# Altium project GatewayRPICM5.PrjPcb (part 1 of 2)
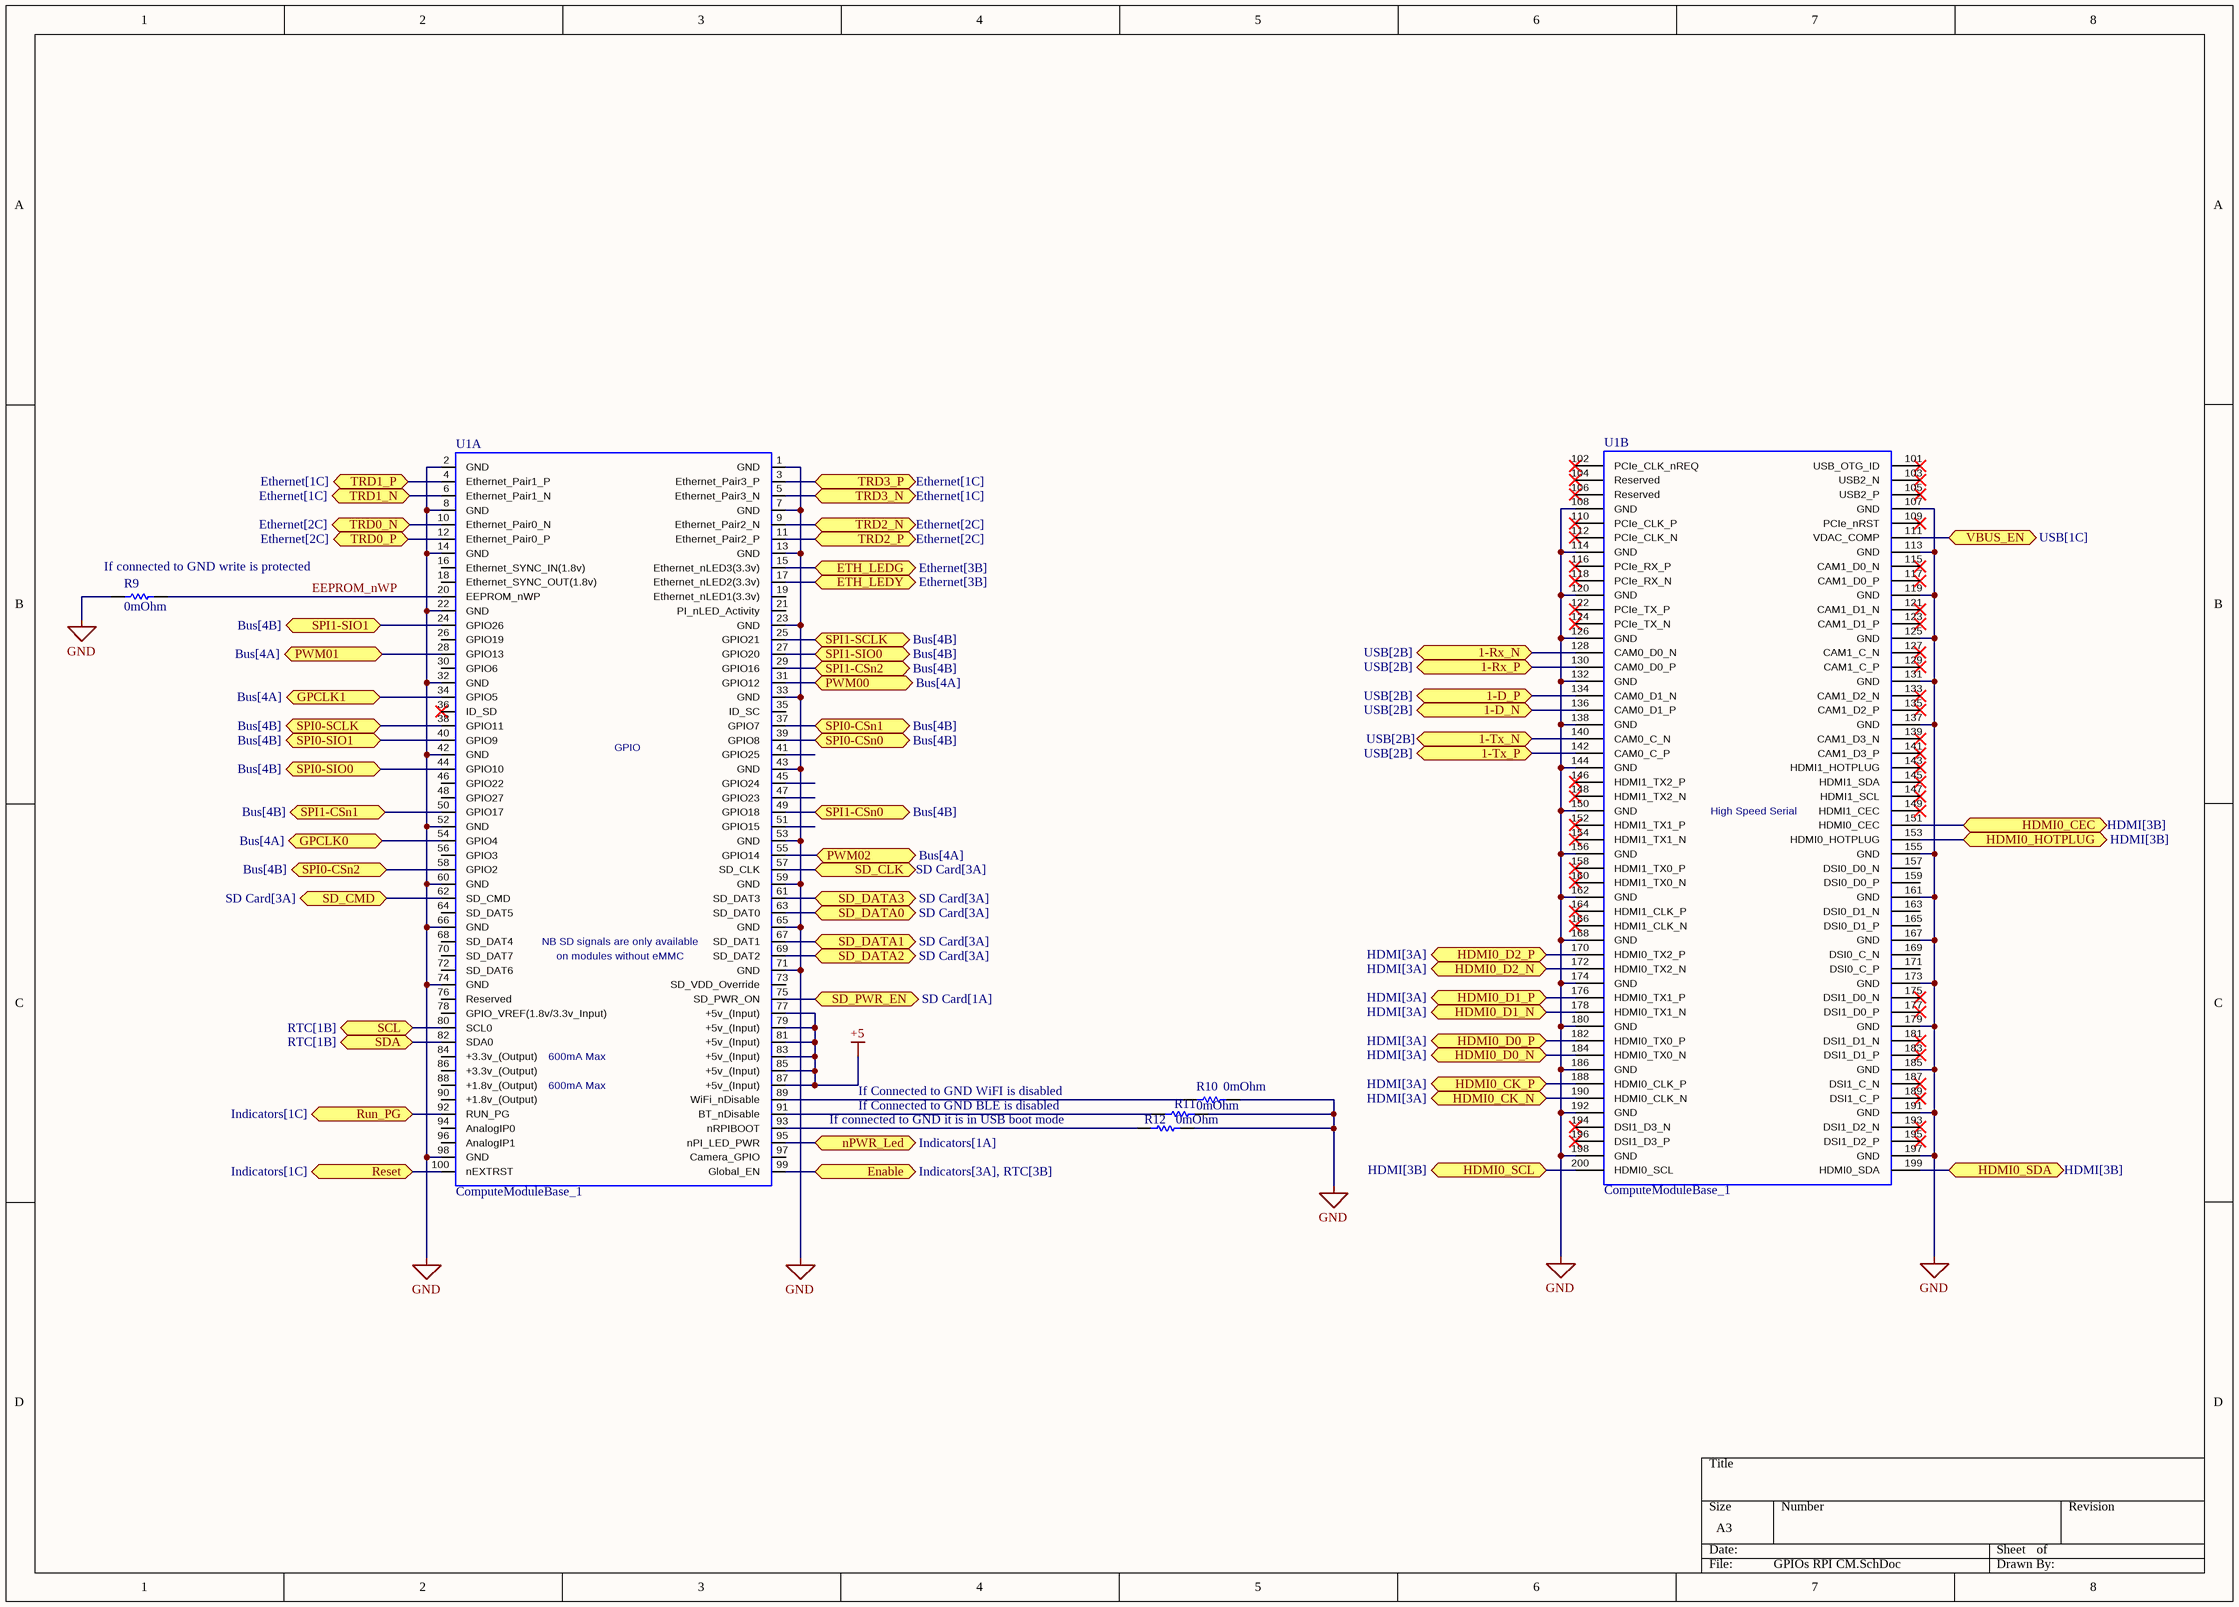
[diagram p0: GPIOs RPI CM.SchDoc]
11 sheets, 79 parts. Net scope: flat (ports and power ports of the same name join across sheets).
Board files: RPI_Gateway 1.0.0.PcbDoc, RPI_Gateway 1.0.1.PcbDoc, RPI_Gateway 1.0.2.PcbDoc
Sheets:
  GPIOs RPI CM.SchDoc
  SD Card.SchDoc
  Ethernet.SchDoc
  HDMI.SchDoc
  Indicators.SchDoc
  USB.SchDoc
  RTC.SchDoc
  Bus.SchDoc
  Security ATECC608.SchDoc
  Power.SchDoc
  High Speed RPI CM.SchDoc

## Sheet GPIOs RPI CM.SchDoc
size A3; SheetNumber: 1; SheetTotal: 11

### Parts
R9  Resistance: 0mOhm  [RESC1005X40X25LL05T05]  (hidden comment: ERJ2GE0R00X)
R10  Resistance: 0mOhm  [RESC1005X40X25LL05T05]  (hidden comment: ERJ2GE0R00X)
R11  Resistance: 0mOhm  [RESC1005X40X25LL05T05]  (hidden comment: ERJ2GE0R00X)
R12  Resistance: 0mOhm  [RESC1005X40X25LL05T05]  (hidden comment: ERJ2GE0R00X)
U1  ComputeModuleBase_1  [Raspberry-Pi-Compute-Module]  (parts A,B of 2)

### Ports
1-D_N (bidir, see USB[2B]), 1-D_P (bidir, see USB[2B]), 1-Rx_N (bidir, see USB[2B]), 1-Rx_P (bidir, see USB[2B]), 1-Tx_N (bidir, see USB[2B]), 1-Tx_P (bidir, see USB[2B]), Enable (bidir, see Indicators[3A], RTC[3B]), ETH_LEDG (bidir, see Ethernet[3B]), ETH_LEDY (bidir, see Ethernet[3B]), GPCLK0 (bidir, see Bus[4A]), GPCLK1 (bidir, see Bus[4A]), HDMI0_CEC (bidir, see HDMI[3B]), HDMI0_CK_N (bidir, see HDMI[3A]), HDMI0_CK_P (bidir, see HDMI[3A]), HDMI0_D0_N (bidir, see HDMI[3A]), HDMI0_D0_P (bidir, see HDMI[3A]), HDMI0_D1_N (bidir, see HDMI[3A]), HDMI0_D1_P (bidir, see HDMI[3A]), HDMI0_D2_N (bidir, see HDMI[3A]), HDMI0_D2_P (bidir, see HDMI[3A]), HDMI0_HOTPLUG (bidir, see HDMI[3B]), HDMI0_SCL (bidir, see HDMI[3B]), HDMI0_SDA (bidir, see HDMI[3B]), nPWR_Led (bidir, see Indicators[1A]), PWM00 (bidir, see Bus[4A]), PWM01 (bidir, see Bus[4A]), PWM02 (bidir, see Bus[4A]), Reset (bidir, see Indicators[1C]), Run_PG (bidir, see Indicators[1C]), SCL (bidir, see RTC[1B]), SD_CLK (bidir, see SD Card[3A]), SD_CMD (bidir, see SD Card[3A]), SD_DATA0 (bidir, see SD Card[3A]), SD_DATA1 (bidir, see SD Card[3A]), SD_DATA2 (bidir, see SD Card[3A]), SD_DATA3 (bidir, see SD Card[3A]), SD_PWR_EN (bidir, see SD Card[1A]), SDA (bidir, see RTC[1B]), SPI0-CSn0 (bidir, see Bus[4B]), SPI0-CSn1 (bidir, see Bus[4B]), SPI0-CSn2 (bidir, see Bus[4B]), SPI0-SCLK (bidir, see Bus[4B]), SPI0-SIO0 (bidir, see Bus[4B]), SPI0-SIO1 (bidir, see Bus[4B]), SPI1-CSn0 (bidir, see Bus[4B]), SPI1-CSn1 (bidir, see Bus[4B]), SPI1-CSn2 (bidir, see Bus[4B]), SPI1-SCLK (bidir, see Bus[4B]), SPI1-SIO0 (bidir, see Bus[4B]), SPI1-SIO1 (bidir, see Bus[4B]), TRD0_N (bidir, see Ethernet[2C]), TRD0_P (bidir, see Ethernet[2C]), TRD1_N (bidir, see Ethernet[1C]), TRD1_P (bidir, see Ethernet[1C]), TRD2_N (bidir, see Ethernet[2C]), TRD2_P (bidir, see Ethernet[2C]), TRD3_N (bidir, see Ethernet[1C]), TRD3_P (bidir, see Ethernet[1C]), VBUS_EN (bidir, see USB[1C])

### Nets
+5: U1.77(+5v_(Input)) U1.79(+5v_(Input)) U1.81(+5v_(Input)) U1.83(+5v_(Input)) U1.85(+5v_(Input)) U1.87(+5v_(Input))
GND: R9.2 R10.2 R11.2 R12.2 U1.1(GND) U1.2(GND) U1.7(GND) U1.8(GND) U1.13(GND) U1.14(GND) U1.22(GND) U1.23(GND) U1.32(GND) U1.33(GND) U1.42(GND) U1.43(GND) U1.52(GND) U1.53(GND) U1.59(GND) U1.60(GND) U1.65(GND) U1.66(GND) U1.71(GND) U1.74(GND) U1.98(GND) U1.107(GND) U1.108(GND) U1.113(GND) U1.114(GND) U1.119(GND) U1.120(GND) U1.125(GND) U1.126(GND) U1.131(GND) U1.132(GND) U1.137(GND) U1.138(GND) U1.144(GND) U1.150(GND) U1.155(GND) U1.156(GND) U1.161(GND) U1.162(GND) U1.167(GND) U1.168(GND) U1.173(GND) U1.174(GND) U1.179(GND) U1.180(GND) U1.185(GND) U1.186(GND) U1.191(GND) U1.192(GND) U1.197(GND) U1.198(GND)
1-D_N: U1.136(CAM0_D1_P) ; port 1-D_N
1-D_P: U1.134(CAM0_D1_N) ; port 1-D_P
1-Rx_N: U1.128(CAM0_D0_N) ; port 1-Rx_N
1-Rx_P: U1.130(CAM0_D0_P) ; port 1-Rx_P
1-Tx_N: U1.140(CAM0_C_N) ; port 1-Tx_N
1-Tx_P: U1.142(CAM0_C_P) ; port 1-Tx_P
CK_N: U1.190(HDMI0_CLK_N) ; port HDMI0_CK_N
CK_P: U1.188(HDMI0_CLK_P) ; port HDMI0_CK_P
D0_N: U1.184(HDMI0_TX0_N) ; port HDMI0_D0_N
D0_P: U1.182(HDMI0_TX0_P) ; port HDMI0_D0_P
D1_N: U1.178(HDMI0_TX1_N) ; port HDMI0_D1_N
D1_P: U1.176(HDMI0_TX1_P) ; port HDMI0_D1_P
D2_N: U1.172(HDMI0_TX2_N) ; port HDMI0_D2_N
D2_P: U1.170(HDMI0_TX2_P) ; port HDMI0_D2_P
EEPROM_nWP: R9.1 U1.20(EEPROM_nWP)
Modem Reset: U1.92(RUN_PG) U1.100(nEXTRST) ; port Run_PG, port Reset
NetLabel1: U1.50(GPIO17) ; port SPI1-CSn1
NetLabel2: U1.49(GPIO18) ; port SPI1-CSn0
NetLabel3: U1.29(GPIO16) ; port SPI1-CSn2
NetLabel4: U1.25(GPIO21) ; port SPI1-SCLK
NetLabel5: U1.24(GPIO26) ; port SPI1-SIO1
NetLabel6: U1.27(GPIO20) ; port SPI1-SIO0
NetLabel7: U1.37(GPIO7) ; port SPI0-CSn1
NetLabel8: U1.39(GPIO8) ; port SPI0-CSn0
NetLabel9: U1.58(GPIO2) ; port SPI0-CSn2
NetLabel10: U1.38(GPIO11) ; port SPI0-SCLK
NetLabel12: U1.40(GPIO9) ; port SPI0-SIO1
NetLabel13: U1.44(GPIO10) ; port SPI0-SIO0
NetLabel14: U1.34(GPIO5) ; port GPCLK1
NetLabel15: U1.54(GPIO4) ; port GPCLK0
NetLabel16: U1.28(GPIO13) ; port PWM01
NetLabel17: U1.31(GPIO12) ; port PWM00
NetLabel18: U1.55(GPIO14) ; port PWM02
TRD0_N: U1.10(Ethernet_Pair0_N) ; port TRD0_N
TRD0_P: U1.12(Ethernet_Pair0_P) ; port TRD0_P
TRD1_N: U1.6(Ethernet_Pair1_N) ; port TRD1_N
TRD1_P: U1.4(Ethernet_Pair1_P) ; port TRD1_P
TRD2_N: U1.9(Ethernet_Pair2_N) ; port TRD2_N
TRD2_P: U1.11(Ethernet_Pair2_P) ; port TRD2_P
TRD3_N: U1.5(Ethernet_Pair3_N) ; port TRD3_N
TRD3_P: U1.3(Ethernet_Pair3_P) ; port TRD3_P
NetJ3_1: U1.69(SD_DAT2) ; port SD_DATA2
NetJ3_2: U1.61(SD_DAT3) ; port SD_DATA3
NetJ3_3: U1.62(SD_CMD) ; port SD_CMD
NetJ3_5: U1.57(SD_CLK) ; port SD_CLK
NetJ3_7: U1.63(SD_DAT0) ; port SD_DATA0
NetJ3_8: U1.67(SD_DAT1) ; port SD_DATA1
NetJ5_13: U1.151(HDMI0_CEC) ; port HDMI0_CEC
NetJ5_15: U1.200(HDMI0_SCL) ; port HDMI0_SCL
NetJ5_16: U1.199(HDMI0_SDA) ; port HDMI0_SDA
NetJ5_19: U1.153(HDMI0_HOTPLUG) ; port HDMI0_HOTPLUG
NetR1_1: U1.15(Ethernet_nLED3(3.3v)) ; port ETH_LEDG
NetR2_1: U1.17(Ethernet_nLED2(3.3v)) ; port ETH_LEDY
NetR10_1: R10.1 U1.89(WiFi_nDisable)
NetR11_1: R11.1 U1.91(BT_nDisable)
NetR12_1: R12.1 U1.93(nRPIBOOT)
NetU1_75: U1.75(SD_PWR_ON) ; port SD_PWR_EN
NetU1_80: U1.80(SCL0) ; port SCL
NetU1_82: U1.82(SDA0) ; port SDA
NetU1_95: U1.95(nPI_LED_PWR) ; port nPWR_Led
NetU1_99: U1.99(Global_EN) ; port Enable
NetU1_111: U1.111(VDAC_COMP) ; port VBUS_EN

Not connected (* = marked no-connect by the designer): U1 16(Ethernet_SYNC_IN(1.8v)) 18(Ethernet_SYNC_OUT(1.8v)) 19(Ethernet_nLED1(3.3v)) 21(PI_nLED_Activity) 26(GPIO19) 30(GPIO6) 35(ID_SC) 36(ID_SD)* 41(GPIO25) 45(GPIO24) 46(GPIO22) 47(GPIO23) 48(GPIO27) 51(GPIO15) 56(GPIO3) 64(SD_DAT5) 68(SD_DAT4) 70(SD_DAT7) 72(SD_DAT6) 73(SD_VDD_Override) 76(Reserved) 78(GPIO_VREF(1.8v/3.3v_Input)) 84(+3.3v_(Output)) 86(+3.3v_(Output)) 88(+1.8v_(Output)) 90(+1.8v_(Output)) 94(AnalogIP0) 96(AnalogIP1) 97(Camera_GPIO) 101(USB_OTG_ID)* 102(PCIe_CLK_nREQ)* 103(USB2_N)* 104(Reserved)* 105(USB2_P)* 106(Reserved)* 109(PCIe_nRST)* 110(PCIe_CLK_P)* 112(PCIe_CLK_N)* 115(CAM1_D0_N)* 116(PCIe_RX_P)* 117(CAM1_D0_P)* 118(PCIe_RX_N)* 121(CAM1_D1_N)* 122(PCIe_TX_P)* 123(CAM1_D1_P)* 124(PCIe_TX_N)* 127(CAM1_C_N)* 129(CAM1_C_P)* 133(CAM1_D2_N)* 135(CAM1_D2_P)* 139(CAM1_D3_N)* 141(CAM1_D3_P)* 143(HDMI1_HOTPLUG)* 145(HDMI1_SDA)* 146(HDMI1_TX2_P)* 147(HDMI1_SCL)* 148(HDMI1_TX2_N)* 149(HDMI1_CEC)* 152(HDMI1_TX1_P)* 154(HDMI1_TX1_N)* 157(DSI0_D0_N) 158(HDMI1_TX0_P)* 159(DSI0_D0_P) 160(HDMI1_TX0_N)* 163(DSI0_D1_N) 164(HDMI1_CLK_P)* 165(DSI0_D1_P) 166(HDMI1_CLK_N)* 169(DSI0_C_N) 171(DSI0_C_P) 175(DSI1_D0_N)* 177(DSI1_D0_P)* 181(DSI1_D1_N)* 183(DSI1_D1_P)* 187(DSI1_C_N)* 189(DSI1_C_P)* 193(DSI1_D2_N)* 194(DSI1_D3_N)* 195(DSI1_D2_P)* 196(DSI1_D3_P)*

### Notes on the sheet
- (near R9) If connected to GND write is protected
- If connected to GND it is in USB boot mode
- If Connected to GND WiFI is disabled
- If Connected to GND BLE is disabled
- (in symbol ComputeModuleBase_1, part A) GPIO; NB SD signals are only available; on modules without eMMC; 600mA Max
- (in symbol ComputeModuleBase_1, part B) High Speed Serial

### Library data of the parts
R9-R12 = CMP-2000-07451-1: Chip Resistor, 0 Ohm, 0.1 W, -55 to 155 degC, 0402 (1005 Metric), RoHS, Tape and Reel; Manufacturer: Panasonic; Voltage Rating (DC): 50V; Temperature Coefficient: 600ppm/��C; Max Power Dissipation: 100mW; Tolerance: 5%; Number of Terminations: 2; Mount: SurfaceMount; Height: 0.35mm; Packaging: TapeandReel; Contact Plating: Tin; Manufacturer URL: http://www.panasonic.com/; Composition: ThickFilm; Max Operating Temperature: 155degC; REACH SVHC: NoSVHC; Case/Package: 0402; Package Reference: 402; Depth: 0.5mm; Package Description: 2-Pin Surface Mount Device, Body 1 x 0.5 mm; Datasheet URL: https://industrial.panasonic.com/cdbs/www-data/pdf/RDA0000/AOA0000C301.pdf; RoHSCompliant: True; Case Code (Imperial): 0402; Military Standard: Not; Min Operating Temperature: -55degC; Power Rating: 100mW; Datasheet Version: 03/2015; Length: 1mm; Case Code (Metric): 1005; Termination: SMD/SMT; Mounting Technology: SurfaceMount; Voltage Rating: 50V; Width: 0.02inch; Package Quantity: 1; Lead Free: LeadFree; Radiation Hardening: No
U1 = ComputeModuleBase_1: Compute Module Holder

## Sheet SD Card.SchDoc
size A4; SheetNumber: 2; SheetTotal: 11
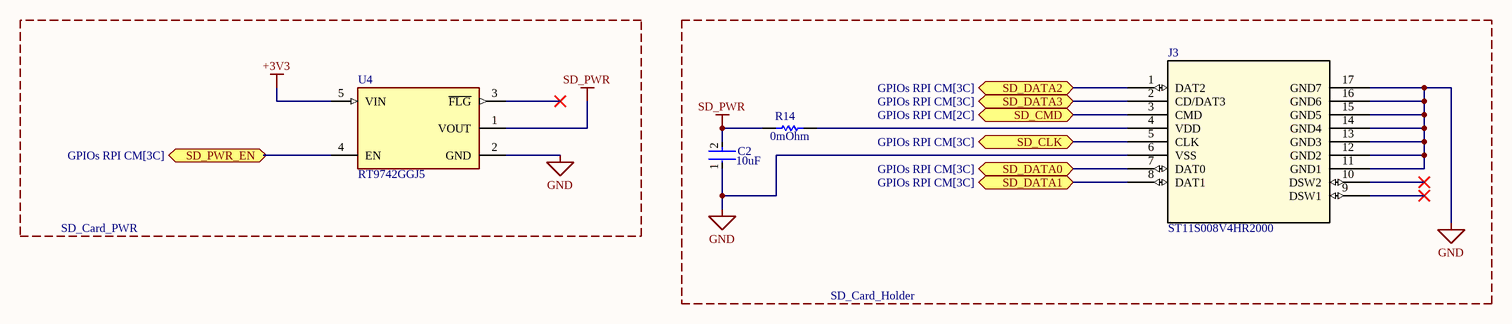
[diagram p1: SD Card.SchDoc]

### Parts
C2  Capacitance: 10uF  [FP-C1608-080-0_1-MFG]  (hidden comment: C1608X5R1A106K080AC)
J3  ST11S008V4HR2000  [ST11S008V4HR2000_JAE]
R14  Resistance: 0mOhm  [RESC1005X40X25LL05T05]  (hidden comment: ERJ2GE0R00X)
U4  RT9742GGJ5  [FP-RT9742GGJ5-IPC_C]

### Blocks framed on the sheet
SD_Card_PWR: U4
SD_Card_Holder: C2 J3 R14

### Ports
SD_CLK (bidir, see GPIOs RPI CM[3C]), SD_CMD (bidir, see GPIOs RPI CM[2C]), SD_DATA0 (bidir, see GPIOs RPI CM[3C]), SD_DATA1 (bidir, see GPIOs RPI CM[3C]), SD_DATA2 (bidir, see GPIOs RPI CM[3C]), SD_DATA3 (bidir, see GPIOs RPI CM[3C]), SD_PWR_EN (bidir, see GPIOs RPI CM[3C])

### Nets
+3V3: U4.5(VIN)
GND: C2.1 J3.6(VSS) J3.11(GND1) J3.12(GND2) J3.13(GND3) J3.14(GND4) J3.15(GND5) J3.16(GND6) J3.17(GND7) U4.2(GND)
SD_PWR: C2.2 R14.1 U4.1(VOUT)
NetJ3_1: J3.1(DAT2) ; port SD_DATA2
NetJ3_2: J3.2(CD/DAT3) ; port SD_DATA3
NetJ3_3: J3.3(CMD) ; port SD_CMD
NetJ3_4: J3.4(VDD) R14.2
NetJ3_5: J3.5(CLK) ; port SD_CLK
NetJ3_7: J3.7(DAT0) ; port SD_DATA0
NetJ3_8: J3.8(DAT1) ; port SD_DATA1
NetU1_75: U4.4(EN) ; port SD_PWR_EN

Not connected (* = marked no-connect by the designer): J3 9(DSW1)* 10(DSW2)*; U4 3(~{FLG})*

### Library data of the parts
C2 = CMP-2000-04979-3: Multilayer Ceramic Capacitors 10μF ±10% 10V X5R SMD 0603; Dielectric Material: Ceramic; Construction: Flat; Height: 0.8mm; Thickness: 0.035inch; Case Code (Metric): 1608; Radiation Hardening: No; Number of Pins: 2; Voltage Rating (DC): 10V; Depth: 0.8mm; Voltage: 10V; RoHS Compliant: Yes; Voltage Rating: 10V; Package Quantity: 1; Resistor Type: Ceramic; Termination: SMD/SMT; Lead Free: Lead Free; REACH SVHC: No SVHC; Tolerance: 10%; Mount: Surface Mount; Series: C; Packaging: Tape and Reel; Width: 0.8mm; Dielectric: X5R; Weight: 7.1E-05oz; Length: 1.6mm; Max Operating Temperature: 85°C; Case Code (Imperial): 0603; Case/Package: 0603; Min Operating Temperature: -55°C
J3 = ST11S008V4HR2000: SD Card; Mfr_Name: JAE Electronics; RefDes: RefDes; Type: Type
R14 = CMP-2000-07451-1: as R9 on sheet GPIOs RPI CM; Number of Terminations: 2; Mount: SurfaceMount; Height: 0.35mm; Packaging: TapeandReel; Contact Plating: Tin; Manufacturer URL: http://www.panasonic.com/; Composition: ThickFilm; Max Operating Temperature: 155degC; REACH SVHC: NoSVHC; Case/Package: 0402; Package Reference: 402; Depth: 0.5mm; Package Description: 2-Pin Surface Mount Device, Body 1 x 0.5 mm; Datasheet URL: https://industrial.panasonic.com/cdbs/www-data/pdf/RDA0000/AOA0000C301.pdf; RoHSCompliant: True; Case Code (Imperial): 0402; Military Standard: Not; Min Operating Temperature: -55degC; Power Rating: 100mW; Datasheet Version: 03/2015; Length: 1mm; Case Code (Metric): 1005; Termination: SMD/SMT; Mounting Technology: SurfaceMount; Voltage Rating: 50V; Width: 0.02inch; Package Quantity: 1; Lead Free: LeadFree; Radiation Hardening: No
U4 = CMP-79883-000001-1: IC PWR SWTCH N-CHAN 1:1 TSOT23-5; Interface: On/Off; Fault Protection: Over Temperature; Max Output Current: 1A; Number of Outputs: 1; Output Configuration: High Side; On-State Resistance: 70mR; REACH SVHC: No SVHC; Number of Pins: 23; Packaging: Tape and Reel; Case/Package: SOT-23-5; RoHS Compliant: Yes; Max Operating Temperature: 85°C; Min Operating Temperature: -40°C

## Sheet Ethernet.SchDoc
size A4; SheetNumber: 3; SheetTotal: 11
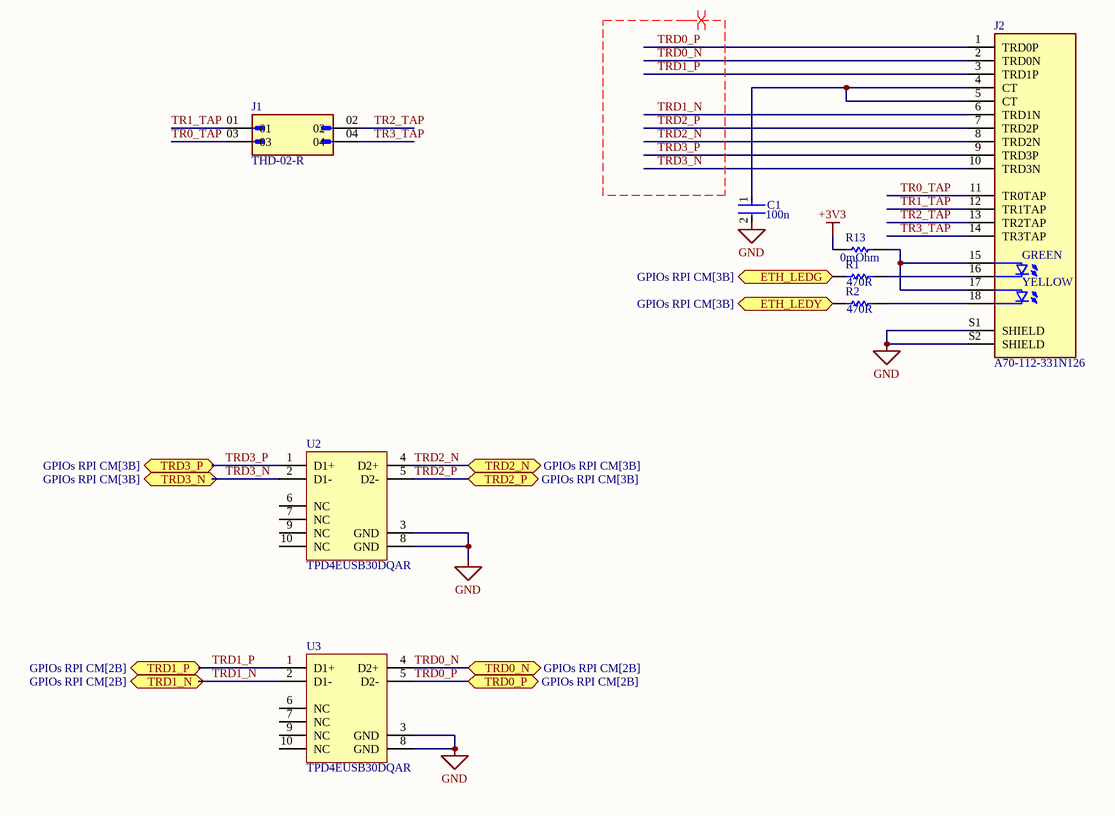
[diagram p2: Ethernet.SchDoc]

### Parts
C1  Capacitance: 100n  [FP-C0402-BB-MFG]  (hidden comment: C0402C104K8PACTU)
J1  THD-02-R  [VALCON_THD-02-R]
J2  A70-112-331N126  [EDAC_A70-112-331N126]
R1  value 470R  [RESC2013X50X30LL20T20]  (hidden comment: CRCW0805470RFKEA)
R2  value 470R  [RESC2013X50X30LL20T20]  (hidden comment: CRCW0805470RFKEA)
R13  Resistance: 0mOhm  [RESC1005X40X25LL05T05]  (hidden comment: ERJ2GE0R00X)
U2  TPD4EUSB30DQAR  [DQA0010A_V]
U3  TPD4EUSB30DQAR  [DQA0010A_V]

### Ports
ETH_LEDG (bidir, see GPIOs RPI CM[3B]), ETH_LEDY (bidir, see GPIOs RPI CM[3B]), TRD0_N (bidir, see GPIOs RPI CM[2B]), TRD0_P (bidir, see GPIOs RPI CM[2B]), TRD1_N (bidir, see GPIOs RPI CM[2B]), TRD1_P (bidir, see GPIOs RPI CM[2B]), TRD2_N (bidir, see GPIOs RPI CM[3B]), TRD2_P (bidir, see GPIOs RPI CM[3B]), TRD3_N (bidir, see GPIOs RPI CM[3B]), TRD3_P (bidir, see GPIOs RPI CM[3B])

### Nets
+3V3: R13.1
GND: C1.2 J2.S1(SHIELD) J2.S2(SHIELD) U2.3(GND) U2.8(GND) U3.3(GND) U3.8(GND)
TR0_TAP: J1.03 J2.11(TR0TAP)
TR1_TAP: J1.01 J2.12(TR1TAP)
TR2_TAP: J1.02 J2.13(TR2TAP)
TR3_TAP: J1.04 J2.14(TR3TAP)
TRD0_N: J2.2(TRD0N) U3.4(D2+) ; port TRD0_N
TRD0_P: J2.1(TRD0P) U3.5(D2-) ; port TRD0_P
TRD1_N: J2.6(TRD1N) U3.2(D1-) ; port TRD1_N
TRD1_P: J2.3(TRD1P) U3.1(D1+) ; port TRD1_P
TRD2_N: J2.8(TRD2N) U2.4(D2+) ; port TRD2_N
TRD2_P: J2.7(TRD2P) U2.5(D2-) ; port TRD2_P
TRD3_N: J2.10(TRD3N) U2.2(D1-) ; port TRD3_N
TRD3_P: J2.9(TRD3P) U2.1(D1+) ; port TRD3_P
NetC1_1: C1.1 J2.4(CT) J2.5(CT)
NetJ2_15: J2.15(Anode) J2.17(Anode) R13.2
NetJ2_16: J2.16(Cathode) R1.2
NetJ2_18: J2.18(Cathode) R2.2
NetR1_1: R1.1 ; port ETH_LEDG
NetR2_1: R2.1 ; port ETH_LEDY

Not connected (* = marked no-connect by the designer): U2 6(NC) 7(NC) 9(NC) 10(NC); U3 6(NC) 7(NC) 9(NC) 10(NC)

### Layout directives
differential pair: TRD0_N, TRD0_P, TRD1_N, TRD1_P, TRD2_N, TRD2_P, TRD3_N, TRD3_P

### Notes on the sheet
- (in symbol A70-112-331N126) GREEN; YELLOW

### Library data of the parts
C1 = CMP-2008-02046-2: CAP CER 0.1UF 10V X5R 0402; Manufacturer: Kemet; Material: Ceramic; Temperature Coefficient: 15%; Tolerance: 0.1; Value: 0.10 μF; Package: C0402-BB; Temperature: -55°C to +125°C; ComponentLink2Description: Datasheet; Temperature Characteristic: X5R; Device Class L1: Passive Components; Height: 0.55mm; Lead Free: Yes; ComponentLink2URL: https://content.kemet.com/datasheets/KEM_C1002_X7R_SMD.pdf; Device Class L2: Capacitors; Temperature Range Low: -55°C; Temperature Range High: +125°C; RoHS: TRUE; Octopart: https://octopart.com/c0402c104k8pactu-kemet-140039; Automotive: No; Mouser Description: Capacitor 100 nF 10 VDC 0402; Category: Cap; Voltage Rating: 10 V; Digikey Description: CAP CER 0.1UF 10V X5R 0402; Ipc Land Pattern Name: CAPC10050X50; Device Class L3: Ceramic Capacitors; Manufacturer Part Number: C0402C104K8PACTU
J1 = THD-02-R: THD - Valcon 2.54mm Pitch Dual Row Pin Header - Fast Stock; Check_prices: https://www.snapeda.com/parts/THD-02-R/Valcon/view-part/4777189/?ref=eda; Package: None; Purchase-URL: https://pricing.snapeda.com/search/part/THD-02-R/?ref=eda; MP: THD-02-R; Value: *; Availability: No availability data; SnapEDA_Link: https://www.snapeda.com/parts/THD-02-R/Valcon/view-part/4777189/?ref=snap; Price: None; MF: Valcon
J2 = A70-112-331N126: Ethernet RPI; Package: None; Availability: Unavailable; MP: A70-112-331N126; Value: *; Price: None
R1 R2 = CMP-2001-03932-1: Manufacturer: Vishay Dale; Part Number: CRCW0805470RFKEA
R13 = CMP-2000-07451-1: as R9 on sheet GPIOs RPI CM; Number of Terminations: 2; Mount: SurfaceMount; Height: 0.35mm; Packaging: TapeandReel; Contact Plating: Tin; Manufacturer URL: http://www.panasonic.com/; Composition: ThickFilm; Max Operating Temperature: 155degC; REACH SVHC: NoSVHC; Case/Package: 0402; Package Reference: 402; Depth: 0.5mm; Package Description: 2-Pin Surface Mount Device, Body 1 x 0.5 mm; Datasheet URL: https://industrial.panasonic.com/cdbs/www-data/pdf/RDA0000/AOA0000C301.pdf; RoHSCompliant: True; Case Code (Imperial): 0402; Military Standard: Not; Min Operating Temperature: -55degC; Power Rating: 100mW; Datasheet Version: 03/2015; Length: 1mm; Case Code (Metric): 1005; Termination: SMD/SMT; Mounting Technology: SurfaceMount; Voltage Rating: 50V; Width: 0.02inch; Package Quantity: 1; Lead Free: LeadFree; Radiation Hardening: No
U2 U3 = CMP-0326-00027-3: ESD Solution for Super-Speed (6 GBPS) USB 3.0 Interface, 4 Channels, -40 to +85 degC, 10-pin SON (DQA), Green (RoHS & no Sb/Br); Manufacturer: Texas Instruments; Differential Capacitance(pF): 0.05; Serial ATA / eSATA: TRUE; IO Capacitance(Typ)(pF): 0.8; IO Leakage Current(nA): 10; IEC 61000-4-2 Air-Gap(+/- kV): 8; ComponentLink3Description: URL Link1; PartNumber: TPD4EUSB30DQAR; DatasheetVersion: SLVSAC2C; ComponentLink2URL: http://www.ti.com/general/docs/lit/getliterature.tsp?genericPartNumber=TPD4EUSB30&fileType=pdf; USB Super Speed: TRUE; Eco-Plan: Green (RoHS & no Sb/Br); Mounting Technology: Surface Mount; 1394 / Firewire: TRUE; PackageVersion: revB, Sep-2009; SubFamily: ESD Solution; USB Full Speed: TRUE; USB High Speed: TRUE; ComponentLink2Description: Datasheet; ComponentLink1URL: http://www.ti.com/; IEC 61000-4-2 Contact(+/- kV): 8; Breakdown Voltage(Min)(V): 8; PackageReference: DQA0010A; ComponentLink1Description: Manufacturer URL; PackageDescription: 10-Pin Plastic Small Outline No-Lead, 1 x 2.5 x 0.55 mm Body, 0.5 mm Pitch; ComponentLink3URL: SamplesURL:http://www.ti.com/product/tpd4eusb30#samples; HDMI: TRUE

## Sheet HDMI.SchDoc
size A4; SheetNumber: 4; SheetTotal: 11
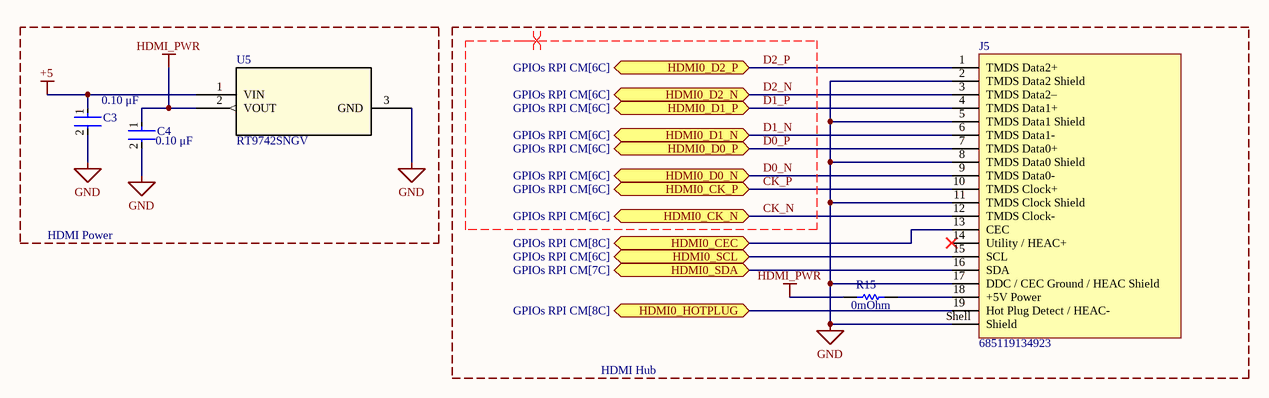
[diagram p3: HDMI.SchDoc]

### Parts
C3  Capacitance: 0.10 μF  [FP-C0402-BB-MFG]  (hidden comment: C0402C104K8PACTU)
C4  Capacitance: 0.10 μF  [FP-C0402-BB-MFG]  (hidden comment: C0402C104K8PACTU)
J5  685119134923  [685119134923]
R15  Resistance: 0mOhm  [RESC1005X40X25LL05T05]  (hidden comment: ERJ2GE0R00X)
U5  RT9742SNGV  [SOT_42SNGV_RIT]

### Blocks framed on the sheet
HDMI Power: C3 C4 U5
HDMI Hub: J5 R15

### Ports
HDMI0_CEC (bidir, see GPIOs RPI CM[8C]), HDMI0_CK_N (bidir, see GPIOs RPI CM[6C]), HDMI0_CK_P (bidir, see GPIOs RPI CM[6C]), HDMI0_D0_N (bidir, see GPIOs RPI CM[6C]), HDMI0_D0_P (bidir, see GPIOs RPI CM[6C]), HDMI0_D1_N (bidir, see GPIOs RPI CM[6C]), HDMI0_D1_P (bidir, see GPIOs RPI CM[6C]), HDMI0_D2_N (bidir, see GPIOs RPI CM[6C]), HDMI0_D2_P (bidir, see GPIOs RPI CM[6C]), HDMI0_HOTPLUG (bidir, see GPIOs RPI CM[8C]), HDMI0_SCL (bidir, see GPIOs RPI CM[6C]), HDMI0_SDA (bidir, see GPIOs RPI CM[7C])

### Nets
+5: C3.1 U5.1(VIN)
GND: C3.2 C4.2 J5.2(TMDS_Data2_Shield) J5.5(TMDS_Data1_Shield) J5.8(TMDS_Data0_Shield) J5.11(TMDS_Clock_Shield) J5.17(DDC_/_CEC_Ground_/_HEAC_Shield) J5.Shell(Shield) U5.3(GND)
HDMI_PWR: C4.1 R15.1 U5.2(VOUT)
CK_N: J5.12(TMDS_Clock-) ; port HDMI0_CK_N
CK_P: J5.10(TMDS_Clock+) ; port HDMI0_CK_P
D0_N: J5.9(TMDS_Data0-) ; port HDMI0_D0_N
D0_P: J5.7(TMDS_Data0+) ; port HDMI0_D0_P
D1_N: J5.6(TMDS_Data1-) ; port HDMI0_D1_N
D1_P: J5.4(TMDS_Data1+) ; port HDMI0_D1_P
D2_N: J5.3(TMDS_Data2–) ; port HDMI0_D2_N
D2_P: J5.1(TMDS_Data2+) ; port HDMI0_D2_P
NetJ5_13: J5.13(CEC) ; port HDMI0_CEC
NetJ5_15: J5.15(SCL) ; port HDMI0_SCL
NetJ5_16: J5.16(SDA) ; port HDMI0_SDA
NetJ5_18: J5.18(+5V_Power) R15.2
NetJ5_19: J5.19(Hot_Plug_Detect_/_HEAC-) ; port HDMI0_HOTPLUG

Not connected (* = marked no-connect by the designer): J5 14(Utility_/_HEAC+)*

### Layout directives
differential pair: CK_N, CK_P, D0_N, D0_P, D1_N, D1_P, D2_N, D2_P

### Library data of the parts
C3 C4 = CMP-2008-02046-2: as C1 on sheet Ethernet; Package: C0402-BB; Temperature: -55°C to +125°C; ComponentLink2Description: Datasheet; Temperature Characteristic: X5R; Device Class L1: Passive Components; Height: 0.55mm; Lead Free: Yes; ComponentLink2URL: https://content.kemet.com/datasheets/KEM_C1002_X7R_SMD.pdf; Device Class L2: Capacitors; Temperature Range Low: -55°C; Temperature Range High: +125°C; RoHS: TRUE; Octopart: https://octopart.com/c0402c104k8pactu-kemet-140039; Automotive: No; Mouser Description: Capacitor 100 nF 10 VDC 0402; Category: Cap; Voltage Rating: 10 V; Digikey Description: CAP CER 0.1UF 10V X5R 0402; Ipc Land Pattern Name: CAPC10050X50; Device Class L3: Ceramic Capacitors; Manufacturer Part Number: C0402C104K8PACTU
J5 = CMP-1502-00169-3: NexarPartId: 18818285; Connector Type: HDMI; Contact Resistance: 30mΩ; Current Rating: 500mA; Gender: Receptacle; Insulation Resistance: 10MΩ; Number of Contacts: 19; Body Material: Plastic; Voltage Rating: 40V; REACH SVHC: Unknown; Length: 12.15mm; Orientation: Horizontal; Packaging: Tape and Reel; Number of Pins: 19; Min Operating Temperature: -25°C; Termination: SMD/SMT; Height: 5.55mm; Features: Shielded; Number of Positions: 19; Width: 15mm; Mount: Horizontal, Surface Mount; Color: Black; Contact Material: Bronze, Gold; RoHS: Compliant; Max Operating Temperature: 85°C
R15 = CMP-2000-07451-1: as R9 on sheet GPIOs RPI CM; Number of Terminations: 2; Mount: SurfaceMount; Height: 0.35mm; Packaging: TapeandReel; Contact Plating: Tin; Manufacturer URL: http://www.panasonic.com/; Composition: ThickFilm; Max Operating Temperature: 155degC; REACH SVHC: NoSVHC; Case/Package: 0402; Package Reference: 402; Depth: 0.5mm; Package Description: 2-Pin Surface Mount Device, Body 1 x 0.5 mm; Datasheet URL: https://industrial.panasonic.com/cdbs/www-data/pdf/RDA0000/AOA0000C301.pdf; RoHSCompliant: True; Case Code (Imperial): 0402; Military Standard: Not; Min Operating Temperature: -55degC; Power Rating: 100mW; Datasheet Version: 03/2015; Length: 1mm; Case Code (Metric): 1005; Termination: SMD/SMT; Mounting Technology: SurfaceMount; Voltage Rating: 50V; Width: 0.02inch; Package Quantity: 1; Lead Free: LeadFree; Radiation Hardening: No
U5 = RT9742SNGV: HDMI Power; Mfr_Name: Richtek Technology; RefDes: RefDes; Type: Type

## Sheet Indicators.SchDoc
size A4; SheetNumber: 5; SheetTotal: 11
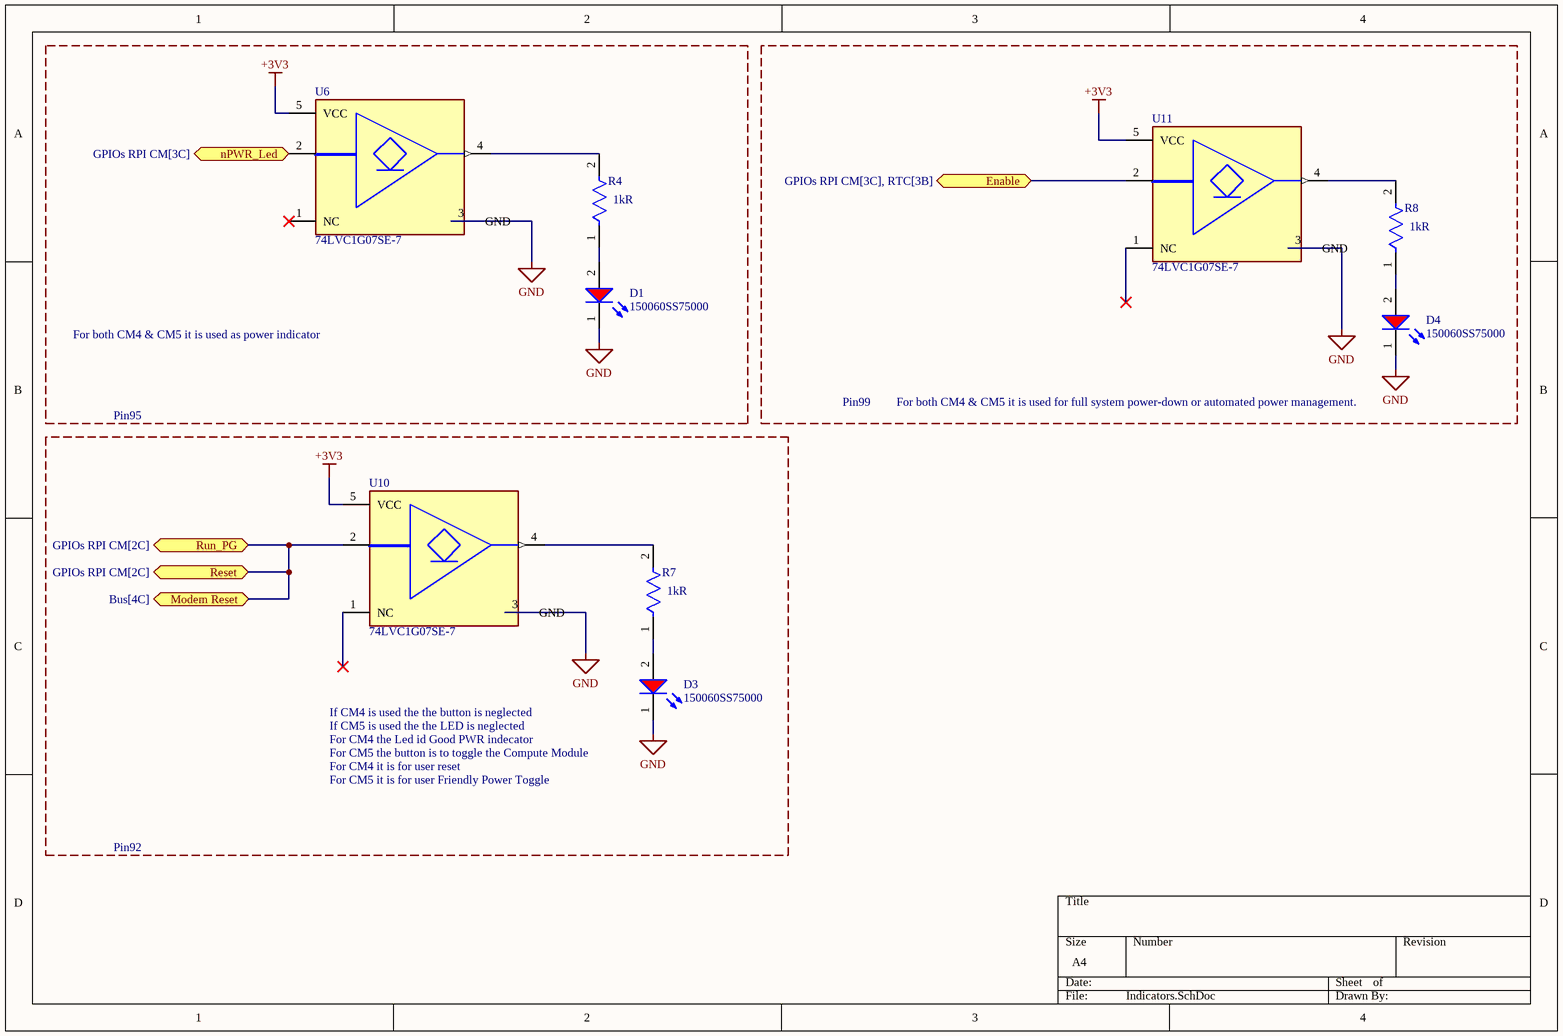
[diagram p4: Indicators.SchDoc]

### Parts
D1  150060SS75000  [WL-SMCW_0603_150060xx75000]
D3  150060SS75000  [WL-SMCW_0603_150060xx75000]
D4  150060SS75000  [WL-SMCW_0603_150060xx75000]
R4  Resistance: 1kR  [FP-ERA3A-IPC_C]  (hidden comment: ERA-3AEB102V)
R7  Resistance: 1kR  [FP-ERA3A-IPC_C]  (hidden comment: ERA-3AEB102V)
R8  Resistance: 1kR  [FP-ERA3A-IPC_C]  (hidden comment: ERA-3AEB102V)
U6  74LVC1G07SE-7  [FP-SOT353-MFG]
U10  74LVC1G07SE-7  [FP-SOT353-MFG]
U11  74LVC1G07SE-7  [FP-SOT353-MFG]

### Blocks framed on the sheet
Pin99: D4 R8 U11

### Ports
Enable (bidir, see GPIOs RPI CM[3C], RTC[3B]), Modem Reset (bidir, see Bus[4C]), nPWR_Led (bidir, see GPIOs RPI CM[3C]), Reset (bidir, see GPIOs RPI CM[2C]), Run_PG (bidir, see GPIOs RPI CM[2C])

### Nets
+3V3: U6.5(VCC) U10.5(VCC) U11.5(VCC)
GND: D1.1(K) D3.1(K) D4.1(K) U6.3(GND) U10.3(GND) U11.3(GND)
Modem Reset: U10.2(A) ; port Run_PG, port Reset, port Modem Reset
NetD1_2: D1.2(A) R4.1
NetD3_2: D3.2(A) R7.1
NetD4_2: D4.2(A) R8.1
NetR4_2: R4.2 U6.4(Y)
NetR7_2: R7.2 U10.4(Y)
NetR8_2: R8.2 U11.4(Y)
NetU1_95: U6.2(A) ; port nPWR_Led
NetU1_99: U11.2(A) ; port Enable

Not connected (* = marked no-connect by the designer): U6 1(NC)*; U10 1(NC)*; U11 1(NC)*

### Notes on the sheet
- For both CM4 & CM5 it is used as power indicator
- Pin95
- For both CM4 & CM5 it is used for full system power-down or automated power management.
- If CM4 is used the the button is neglected
- For CM4 the Led id Good PWR indecator
- If CM5 is used the the LED is neglected
- For CM5 the button is to toggle the Compute Module
- For CM5 it is for user Friendly Power Toggle
- For CM4 it is for user reset
- Pin92

### Library data of the parts
D1 D3 D4 = CMP-1426-00004-3: Led, Red, 630 Nm, 1.9 V, 30 Ma, 60 Mcd Rohs Compliant: Yes; Dominant Wavelength: 630nm; Lens Style: Clear, Rectangular; Forward Current: 100mA; Test Current: 20mA; Viewing Angle: 140°; Forward Voltage: 1.9V; Peak Wavelength: 645nm; Max Reverse Voltage (DC): 5V; Luminous Intensity: 60mcd; Color: Red; Height: 700µm; Min Operating Temperature: -40°C; Case Code (Imperial): 0603; REACH SVHC: Unknown; RoHS: Compliant; Length: 1.6mm; Case Code (Metric): 1608; Mount: Surface Mount; Wavelength: 630nm; Packaging: Tape and Reel; Max Operating Temperature: 85°C; Width: 800µm; Case/Package: 0603
R4 R7 R8 = CMP-2000-00873-2: RES SMD 1K OHM 0.1% 1/10W 0603; Temperature Coefficient: 25ppm/°C; Voltage Rating: 75V; Max Power Dissipation: 100mW; Technology: METAL FILM; Number of Pins: 2; Packaging: Tape and Reel; Case Code (Imperial): 0603; Case Code (Metric): 1608; Min Operating Temperature: -55°C; REACH SVHC: No SVHC; Length: 1.6mm; Termination: SMD/SMT; Depth: 0.8mm; Resistance Tolerance: 0.1%; Number of Terminations: 2; Width: 0.8mm; Military Standard: Not; Tolerance: 0.1%; Package Quantity: 5000; Contact Plating: Tin; Height: 0.45mm; Construction: Rectangular; Case/Package: 0603; Max Operating Temperature: 155°C; Resistor Type: Thin Film; Series: ERA-3A; Size Code: 0603; RoHS Compliant: Yes; Mount: Surface Mount; Radiation Hardening: No; Power Rating: 100mW
U6 U10 U11 = CMP-12739-000001-1: IC BUF NON-INVERT 5.5V SOT353; Manufacturer: Diodes Inc.; Number Of Outputs: 1; Standoff Height: 0mm; Propagation Delay: 1.7ns; Nominal Supply Current: 0.1uA; Min Supply Voltage: 1.65V; Max Junction Temp: +150°C; Logic Function Desc: Non-Inverting; Temperature: -40°C to +125°C; RoHS: TRUE; ComponentLink2Description: Datasheet; Category: IC; Ipc Land Pattern Name: SOT65P210X100-5; Digikey Description: IC BUF NON-INVERT 5.5V SOT353; Device Class L2: Logic ICs; Number Of Inputs: 1; Height: 1.1mm; Ambient Temperature Range High: +125°C; Lead Free: Yes; Octopart: https://octopart.com/74lvc1g07se-7-diodes+inc.-18882698; Device Class L1: Integrated Circuits (ICs); Number Of Circuits: 1; Max Supply Voltage: 5.5V; Temperature Range Low: -40°C; Manufacturer Part Number: 74LVC1G07SE-7; Device Class L3: Buffers; ComponentLink2URL: https://www.diodes.com/assets/Datasheets/74LVC1G07.pdf; Footprint Url: https://www.diodes.com/assets/Package-Files/SOT353.pdf; Temperature Range High: +125°C; Package: SOT353; Mouser Description: 74LVC Series 5.5 V Surface Mount Single Buffer with Open Drain Output - SOT-353; Automotive: No; Ambient Temperature Range Low: -40°C

## Sheet USB.SchDoc
size A4; SheetNumber: 6; SheetTotal: 11
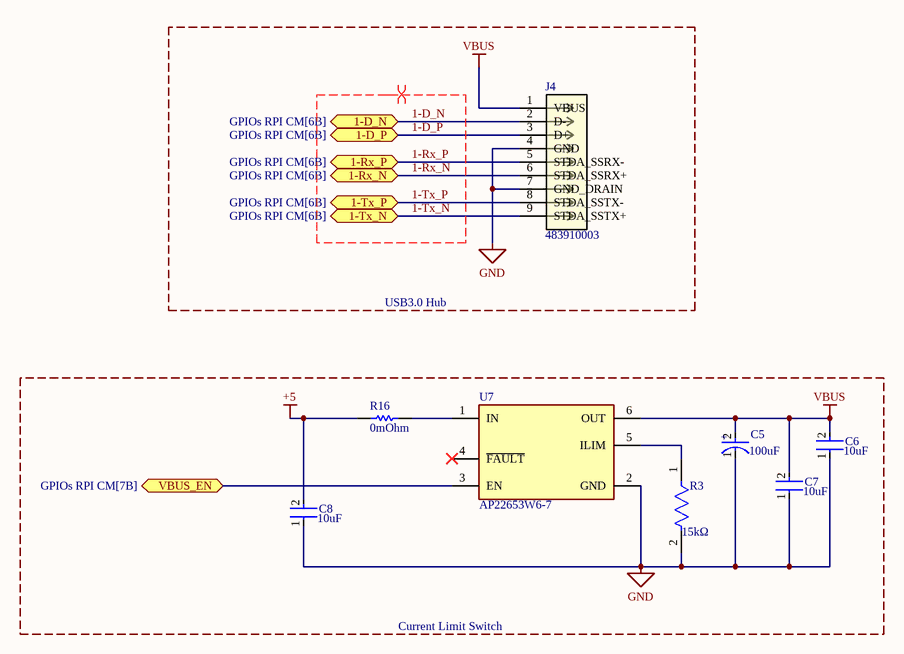
[diagram p5: USB.SchDoc]

### Parts
C5  Capacitance: 100uF  [FP-SC-MFG]  (hidden comment: EEE-1AA101WR)
C6  Capacitance: 10uF  [FP-C1608-080-0_1-MFG]  (hidden comment: C1608X5R1A106K080AC)
C7  Capacitance: 10uF  [FP-C1608-080-0_1-MFG]  (hidden comment: C1608X5R1A106K080AC)
C8  Capacitance: 10uF  [FP-C1608-080-0_1-MFG]  (hidden comment: C1608X5R1A106K080AC)
J4  483910003  [CONN_483910003_MOL]
R3  Resistance: 15kΩ  [FP-ERJ2R-MFG]  (hidden comment: ERJ-2RKF1502X)
R16  Resistance: 0mOhm  [RESC1005X40X25LL05T05]  (hidden comment: ERJ2GE0R00X)
U7  AP22653W6-7  [FP-SOT26-MFG]

### Blocks framed on the sheet
USB3.0 Hub: J4
Current Limit Switch: C5-C8 R3 R16 U7

### Ports
1-D_N (bidir, see GPIOs RPI CM[6B]), 1-D_P (bidir, see GPIOs RPI CM[6B]), 1-Rx_N (bidir, see GPIOs RPI CM[6B]), 1-Rx_P (bidir, see GPIOs RPI CM[6B]), 1-Tx_N (bidir, see GPIOs RPI CM[6B]), 1-Tx_P (bidir, see GPIOs RPI CM[6B]), VBUS_EN (bidir, see GPIOs RPI CM[7B])

### Nets
+5: C8.2 R16.2
GND: C5.1(C) C6.1 C7.1 C8.1 J4.4(GND) J4.7(GND_DRAIN) R3.2 U7.2(GND)
VBUS: C5.2(A) C6.2 C7.2 J4.1(VBUS) U7.6(OUT)
1-D_N: J4.2(D-) ; port 1-D_N
1-D_P: J4.3(D+) ; port 1-D_P
1-Rx_N: J4.6(STDA_SSRX+) ; port 1-Rx_N
1-Rx_P: J4.5(STDA_SSRX-) ; port 1-Rx_P
1-Tx_N: J4.9(STDA_SSTX+) ; port 1-Tx_N
1-Tx_P: J4.8(STDA_SSTX-) ; port 1-Tx_P
NetR3_1: R3.1 U7.5(ILIM)
NetR16_1: R16.1 U7.1(IN)
NetU1_111: U7.3(EN) ; port VBUS_EN

Not connected (* = marked no-connect by the designer): U7 4(~{FAULT})*

### Layout directives
differential pair: 1-D_N, 1-D_P, 1-Rx_N, 1-Rx_P, 1-Tx_N, 1-Tx_P

### Notes on the sheet
- (in symbol CMP-05427-000047-1) +

### Library data of the parts
C5 = CMP-05427-000047-1: CAP ALUM 100UF 20% 10V SMD; Life (Hours): 1000Hour; Ripple Current: 50mA; Packaging: Tape and Reel; Diameter: 5mm; Voltage Rating (DC): 10V; Mount: Surface Mount; Max Operating Temperature: 85°C; Length: 5.5mm; Case/Package: Radial; Height: 5.4mm; Construction: Cylindrical; Termination: SMD/SMT; Height - Seated (Max): 0.213inch; Series: S; Min Operating Temperature: -40°C; Tolerance: 20%; Voltage Rating: 10V; Package Quantity: 1; Radiation Hardening: No; Ripple Current (AC): 50mA; Lead Free: Lead Free; RoHS Compliant: Yes; Contact Plating: Tin
C6-C8 = CMP-2000-04979-3: as C2 on sheet SD Card; Dielectric Material: Ceramic; Construction: Flat; Height: 0.8mm; Thickness: 0.035inch; Case Code (Metric): 1608; Radiation Hardening: No; Number of Pins: 2; Voltage Rating (DC): 10V; Depth: 0.8mm; Voltage: 10V; RoHS Compliant: Yes; Voltage Rating: 10V; Package Quantity: 1; Resistor Type: Ceramic; Termination: SMD/SMT; Lead Free: Lead Free; REACH SVHC: No SVHC; Tolerance: 10%; Mount: Surface Mount; Series: C; Packaging: Tape and Reel; Width: 0.8mm; Dielectric: X5R; Weight: 7.1E-05oz; Length: 1.6mm; Max Operating Temperature: 85°C; Case Code (Imperial): 0603; Case/Package: 0603; Min Operating Temperature: -55°C
J4 = 483910003: No Description Available; Mfr_Name: Molex Connector Corporation; Type: USB, DVI, HDMI, Connectors; RefDes: RefDes
R3 = CMP-2002-00694-4: RES SMD 15K OHM 1% 1/10W 0402; Manufacturer: Panasonic; Automotive Grade: Grade 0; Voltage Rating: 50V; Temperature Coefficient: 100ppm/°C; Power Rating: 0.1W; Value: 15kΩ; ComponentLink2URL: https://industrial.panasonic.com/cdbs/www-data/pdf/RDA0000/AOA0000C304.pdf; Automotive: Yes; Temperature: -55°C to +155°C; Height: 0.4mm; Digikey Description: RES SMD 15K OHM 1% 1/10W 0402; Category: Res; Device Class L2: Resistors; Device Class L1: Passive Components; Package: ERJ2R; Temperature Range Low: -55°C; Tolerance: 1%; Series: ERJ; Manufacturer Part Number: ERJ-2RKF1502X; Footprint Url: https://b2b-api.panasonic.eu/file_stream/pids/fileversion/1180; Mouser Description: Res Thick Film 1.0 x 0.5 mm 15K Ohm 1% 0.1W(1/10W) 100ppm/ C Molded SMD Punched Carrier T/R; Composition: Thick Film; Lead Free: Yes; Device Class L3: Chip SMD Resistors; Octopart: https://octopart.com/erj-2rkf1502x-panasonic-55404985; RoHS: TRUE; Temperature Range High: +155°C; ComponentLink2Description: Datasheet
R16 = CMP-2000-07451-1: as R9 on sheet GPIOs RPI CM; Number of Terminations: 2; Mount: SurfaceMount; Height: 0.35mm; Packaging: TapeandReel; Contact Plating: Tin; Manufacturer URL: http://www.panasonic.com/; Composition: ThickFilm; Max Operating Temperature: 155degC; REACH SVHC: NoSVHC; Case/Package: 0402; Package Reference: 402; Depth: 0.5mm; Package Description: 2-Pin Surface Mount Device, Body 1 x 0.5 mm; Datasheet URL: https://industrial.panasonic.com/cdbs/www-data/pdf/RDA0000/AOA0000C301.pdf; RoHSCompliant: True; Case Code (Imperial): 0402; Military Standard: Not; Min Operating Temperature: -55degC; Power Rating: 100mW; Datasheet Version: 03/2015; Length: 1mm; Case Code (Metric): 1005; Termination: SMD/SMT; Mounting Technology: SurfaceMount; Voltage Rating: 50V; Width: 0.02inch; Package Quantity: 1; Lead Free: LeadFree; Radiation Hardening: No
U7 = CMP-12749-000002-1: LOAD SWITCH,SOT26,T&R,3K

## Sheet RTC.SchDoc
size A4; SheetNumber: 7; SheetTotal: 11
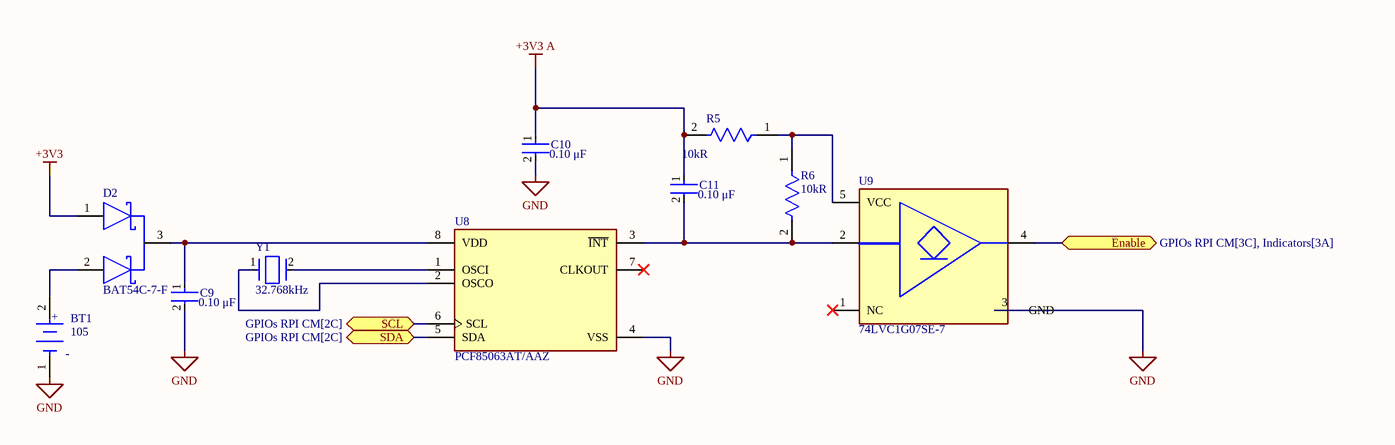
[diagram p6: RTC.SchDoc]

### Parts
BT1  105  [FP-105-MFG]
C9  Capacitance: 0.10 μF  [FP-C0402-BB-IPC_C]  (hidden comment: C0402C104K8PACTU)
C10  Capacitance: 0.10 μF  [FP-C0402-BB-IPC_C]  (hidden comment: C0402C104K8PACTU)
C11  Capacitance: 0.10 μF  [FP-C0402-BB-IPC_C]  (hidden comment: C0402C104K8PACTU)
D2  BAT54C-7-F  [FP-SOT23-IPC_B]
R5  Resistance: 10kR  [FP-RC0603-0_55-IPC_C]  (hidden comment: RC0603FR-0710KL)
R6  Resistance: 10kR  [FP-RC0603-0_55-IPC_C]  (hidden comment: RC0603FR-0710KL)
U8  PCF85063AT/AAZ  [FP-SOT96-1-MFG]
U9  74LVC1G07SE-7  [FP-SOT353-MFG]
Y1  Frequency: 32.768kHz  [FP-ABS07-MFG]  (hidden comment: ABS07-32.768KHZ-T)

### Ports
Enable (bidir, see GPIOs RPI CM[3C], Indicators[3A]), SCL (bidir, see GPIOs RPI CM[2C]), SDA (bidir, see GPIOs RPI CM[2C])

### Nets
+3V3: D2.1(1_ANODE)
+3V3 A: C10.1 C11.1 R5.2
GND: BT1.1(-) C9.2 C10.2 U8.4(VSS) U9.3(GND)
NetBT1_2: BT1.2(+) D2.2(2_ANODE)
NetC9_1: C9.1 D2.3(COMMON_CATHODE) U8.8(VDD)
NetC11_2: C11.2 R6.2 U8.3(~{INT}) U9.2(A)
NetR5_1: R5.1 R6.1 U9.5(VCC)
NetU1_80: U8.6(SCL) ; port SCL
NetU1_82: U8.5(SDA) ; port SDA
NetU1_99: U9.4(Y) ; port Enable
NetU8_1: U8.1(OSCI) Y1.2
NetU8_2: U8.2(OSCO) Y1.1

Not connected (* = marked no-connect by the designer): U8 7(CLKOUT)*; U9 1(NC)*

### Library data of the parts
BT1 = CMP-00214-00028800-1: 105 Battery Holder Coin Cell 1 Cell PC Pin PCB Through Hole Mount PBT 0.944 in. Dia; NexarPartId: 28800; Number of Contacts: 2; Number of Batteries: 1; Approvals: UL; Wire/Cable Gauge: 1AWG; Body Material: Glass, Nylon, PBT; Material: Plastic, Steel; REACH SVHC: No SVHC; Min Operating Temperature: -50°C; Lead Free: Lead Free; Height: 8.75mm; Diameter: 24mm; Termination: PC Pin; Max Operating Temperature: 145°C; Contact Material: Nickel; Number of Cells: 1; Packaging: Bulk; Contact Plating: Nickel; Mount: PCB, Through Hole; RoHS: Compliant
C9-C11 = CMP-2008-02046-2: as C1 on sheet Ethernet; Package: C0402-BB; Temperature: -55°C to +125°C; ComponentLink2Description: Datasheet; Temperature Characteristic: X5R; Device Class L1: Passive Components; Height: 0.55mm; Lead Free: Yes; ComponentLink2URL: https://content.kemet.com/datasheets/KEM_C1002_X7R_SMD.pdf; Device Class L2: Capacitors; Temperature Range Low: -55°C; Temperature Range High: +125°C; RoHS: TRUE; Octopart: https://octopart.com/c0402c104k8pactu-kemet-140039; Automotive: No; Mouser Description: Capacitor 100 nF 10 VDC 0402; Category: Cap; Voltage Rating: 10 V; Digikey Description: CAP CER 0.1UF 10V X5R 0402; Ipc Land Pattern Name: CAPC10050X50; Device Class L3: Ceramic Capacitors; Manufacturer Part Number: C0402C104K8PACTU
D2 = CMP-12790-000084-1: DIODE ARRAY SCHOTTKY 30V SOT23-3; Max Reverse Current: 2uA; Power Dissipation: 200mW; Average Rectified Current: 200mA; Capacitance: 10pF; Peak Non-Repetitive Surge Current: 600mA; Forward Voltage: 800mV; Reverse Recovery Time: 5ns; Element Configuration: Common Cathode; Max Operating Temperature: 150°C; Max Reverse Voltage (DC): 30V; Power Rating: 200mW; Termination: SMD/SMT; REACH SVHC: No SVHC; Voltage Rating (DC): 30V; Series: -; Current Rating: 200mA; RoHS Compliant: Yes; Max Power Dissipation: 200mW; Case/Package: SOT-23; Max Repetitive Reverse Voltage (Vrrm): 30V; Width: 1.3mm; Min Operating Temperature: -65°C; Lead Free: Lead Free; Forward Current: 200mA; Number of Pins: 3; Contact Plating: Tin; Package Quantity: 3000; Length: 2.9mm; Radiation Hardening: No; Max Forward Surge Current (Ifsm): 600mA; Height: 1mm; Packaging: Tape and Reel; Mount: Surface Mount; Weight: 0.000282oz
R5 R6 = CMP-2100-03664-2: RES 10K OHM 1% 1/10W 0603; Voltage Rating: 75V; Voltage Rating (DC): 50V; Power Rating: 100mW; Temperature Coefficient: 100ppm/°C; Depth: 0.8mm; Termination: SMD/SMT; Resistor Type: Thick Film; Series: RC; Construction: Rectangular; Features: Moisture Resistant; Packaging: Tape and Reel; Min Operating Temperature: -55°C; Number of Terminations: 2; Lead Pitch: 0.3mm; RoHS Compliant: Yes; Case/Package: 0603; Resistance Tolerance: 1%; Military Standard: Not; Weight: 7.1E-05oz; Number of Pins: 2; Tolerance: 1%; Length: 1.6mm; Case Code (Imperial): 0603; Lead Free: Lead Free; Width: 0.8mm; Max Power Dissipation: 100mW; Height: 0.45mm; Max Operating Temperature: 155°C; Case Code (Metric): 1608; Size Code: 0603
U8 = CMP-10083-000015-1: IC RTC CLK/CALENDAR I2C 8SOIC; Date Format: YY-MM-DD-dd; Time Format: HH:MM:SS (12/24 hr); RoHS Compliant: Yes; Interface: I2C; Mount: Surface Mount; Min Operating Temperature: -40°C; Lead Free: Lead Free; Packaging: Tape and Reel; Max Operating Temperature: 85°C; Case/Package: SOIC
U9 = CMP-12739-000001-1: as U6 on sheet Indicators; Temperature: -40°C to +125°C; RoHS: TRUE; ComponentLink2Description: Datasheet; Category: IC; Ipc Land Pattern Name: SOT65P210X100-5; Digikey Description: IC BUF NON-INVERT 5.5V SOT353; Device Class L2: Logic ICs; Number Of Inputs: 1; Height: 1.1mm; Ambient Temperature Range High: +125°C; Lead Free: Yes; Octopart: https://octopart.com/74lvc1g07se-7-diodes+inc.-18882698; Device Class L1: Integrated Circuits (ICs); Number Of Circuits: 1; Max Supply Voltage: 5.5V; Temperature Range Low: -40°C; Manufacturer Part Number: 74LVC1G07SE-7; Device Class L3: Buffers; ComponentLink2URL: https://www.diodes.com/assets/Datasheets/74LVC1G07.pdf; Footprint Url: https://www.diodes.com/assets/Package-Files/SOT353.pdf; Temperature Range High: +125°C; Package: SOT353; Mouser Description: 74LVC Series 5.5 V Surface Mount Single Buffer with Open Drain Output - SOT-353; Automotive: No; Ambient Temperature Range Low: -40°C
Y1 = CMP-0447-00001-4: Crystal 32.768kHz ±20ppm (Tol) 12.5pF FUND 70kΩ 2-Pin CSMD T/R; ESR (Equivalent Series Resistance): 70kR; Radiation Hardening: No; Length: 3.2mm; Max Operating Temperature: 85°C; Number of Pins: 2; Series: ABS07; Min Operating Temperature: -40°C; Frequency Tolerance: 20ppm; Packaging: Tape and Reel; Height: 0.9mm; Width: 1.5mm; Depth: 1.5mm; Load Capacitance: 12.5pF; RoHS Compliant: Yes; Tolerance: 20ppm; Termination: SMD/SMT; Lead Free: Lead Free; Series Resistance: 70kR; REACH SVHC: No SVHC; Case/Package: CSMD; Operating Frequency: 32.768 kHz; Package Quantity: 3000

## Sheet Bus.SchDoc
size A4; SheetNumber: 8; SheetTotal: 11
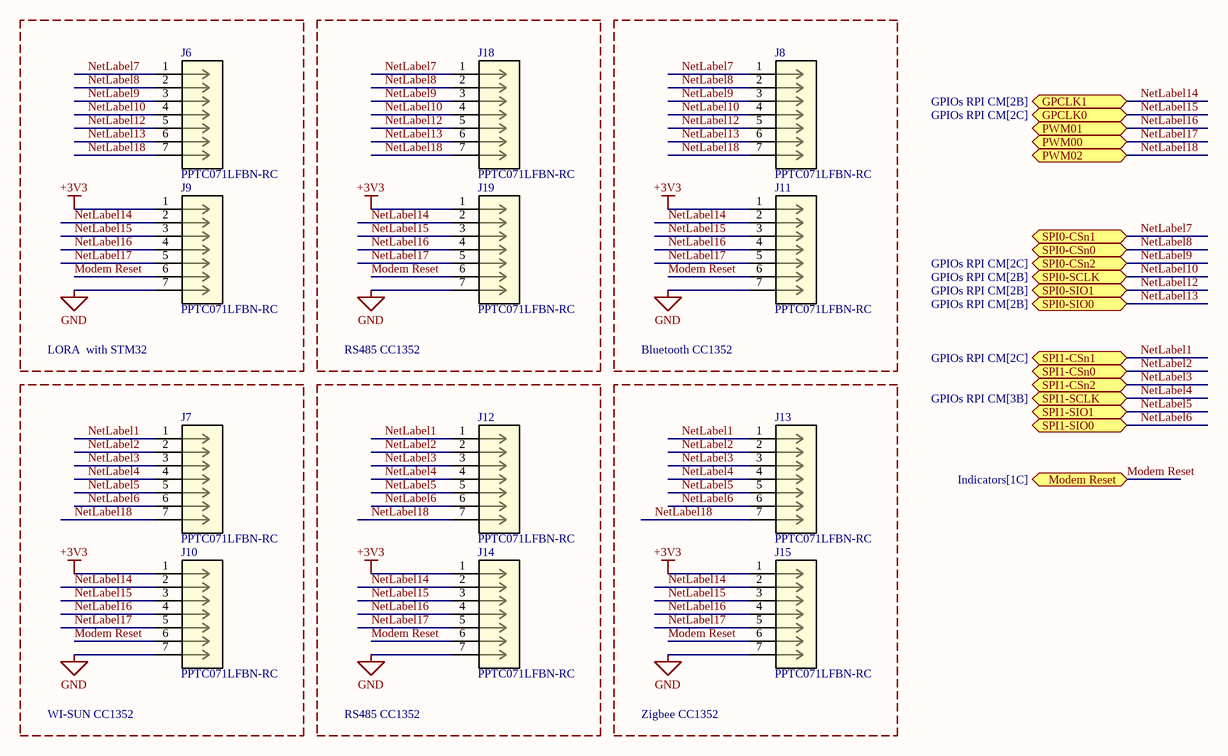
[diagram p7: Bus.SchDoc]

### Parts
J6  PPTC071LFBN-RC  [CONN_xPxC071LFBN-RC_SUL]
J7  PPTC071LFBN-RC  [CONN_xPxC071LFBN-RC_SUL]
J8  PPTC071LFBN-RC  [CONN_xPxC071LFBN-RC_SUL]
J9  PPTC071LFBN-RC  [CONN_xPxC071LFBN-RC_SUL]
J10  PPTC071LFBN-RC  [CONN_xPxC071LFBN-RC_SUL]
J11  PPTC071LFBN-RC  [CONN_xPxC071LFBN-RC_SUL]
J12  PPTC071LFBN-RC  [CONN_xPxC071LFBN-RC_SUL]
J13  PPTC071LFBN-RC  [CONN_xPxC071LFBN-RC_SUL]
J14  PPTC071LFBN-RC  [CONN_xPxC071LFBN-RC_SUL]
J15  PPTC071LFBN-RC  [CONN_xPxC071LFBN-RC_SUL]
J18  PPTC071LFBN-RC  [CONN_xPxC071LFBN-RC_SUL]
J19  PPTC071LFBN-RC  [CONN_xPxC071LFBN-RC_SUL]

### Blocks framed on the sheet
LORA  with STM32: J6 J9
RS485 CC1352: J18 J19
Bluetooth CC1352: J8 J11
WI-SUN CC1352: J7 J10
RS485 CC1352: J12 J14
Zigbee CC1352: J13 J15

### Ports
GPCLK0 (bidir, see GPIOs RPI CM[2C]), GPCLK1 (bidir, see GPIOs RPI CM[2B]), Modem Reset (bidir, see Indicators[1C]), PWM00 (bidir), PWM01 (bidir), PWM02 (bidir), SPI0-CSn0 (bidir), SPI0-CSn1 (bidir), SPI0-CSn2 (bidir, see GPIOs RPI CM[2C]), SPI0-SCLK (bidir, see GPIOs RPI CM[2B]), SPI0-SIO0 (bidir, see GPIOs RPI CM[2B]), SPI0-SIO1 (bidir, see GPIOs RPI CM[2B]), SPI1-CSn0 (bidir), SPI1-CSn1 (bidir, see GPIOs RPI CM[2C]), SPI1-CSn2 (bidir), SPI1-SCLK (bidir, see GPIOs RPI CM[3B]), SPI1-SIO0 (bidir), SPI1-SIO1 (bidir)

### Nets
+3V3: J9.1 J10.1 J11.1 J14.1 J15.1 J19.1
GND: J9.7 J10.7 J11.7 J14.7 J15.7 J19.7
Modem Reset: J9.6 J10.6 J11.6 J14.6 J15.6 J19.6 ; port Modem Reset
NetLabel1: J7.1 J12.1 J13.1 ; port SPI1-CSn1
NetLabel2: J7.2 J12.2 J13.2 ; port SPI1-CSn0
NetLabel3: J7.3 J12.3 J13.3 ; port SPI1-CSn2
NetLabel4: J7.4 J12.4 J13.4 ; port SPI1-SCLK
NetLabel5: J7.5 J12.5 J13.5 ; port SPI1-SIO1
NetLabel6: J7.6 J12.6 J13.6 ; port SPI1-SIO0
NetLabel7: J6.1 J8.1 J18.1 ; port SPI0-CSn1
NetLabel8: J6.2 J8.2 J18.2 ; port SPI0-CSn0
NetLabel9: J6.3 J8.3 J18.3 ; port SPI0-CSn2
NetLabel10: J6.4 J8.4 J18.4 ; port SPI0-SCLK
NetLabel12: J6.5 J8.5 J18.5 ; port SPI0-SIO1
NetLabel13: J6.6 J8.6 J18.6 ; port SPI0-SIO0
NetLabel14: J9.2 J10.2 J11.2 J14.2 J15.2 J19.2 ; port GPCLK1
NetLabel15: J9.3 J10.3 J11.3 J14.3 J15.3 J19.3 ; port GPCLK0
NetLabel16: J9.4 J10.4 J11.4 J14.4 J15.4 J19.4 ; port PWM01
NetLabel17: J9.5 J10.5 J11.5 J14.5 J15.5 J19.5 ; port PWM00
NetLabel18: J6.7 J7.7 J8.7 J12.7 J13.7 J18.7 ; port PWM02

### Library data of the parts
J6-J15 J18 J19 = PPTC071LFBN-RC: No Description Available; Mfr_Name: Sullins; RefDes: RefDes; Type: Type

## Sheet Security ATECC608.SchDoc
size A4; SheetNumber: 9; SheetTotal: 11

## Sheet Power.SchDoc
size A4; SheetNumber: 10; SheetTotal: 11
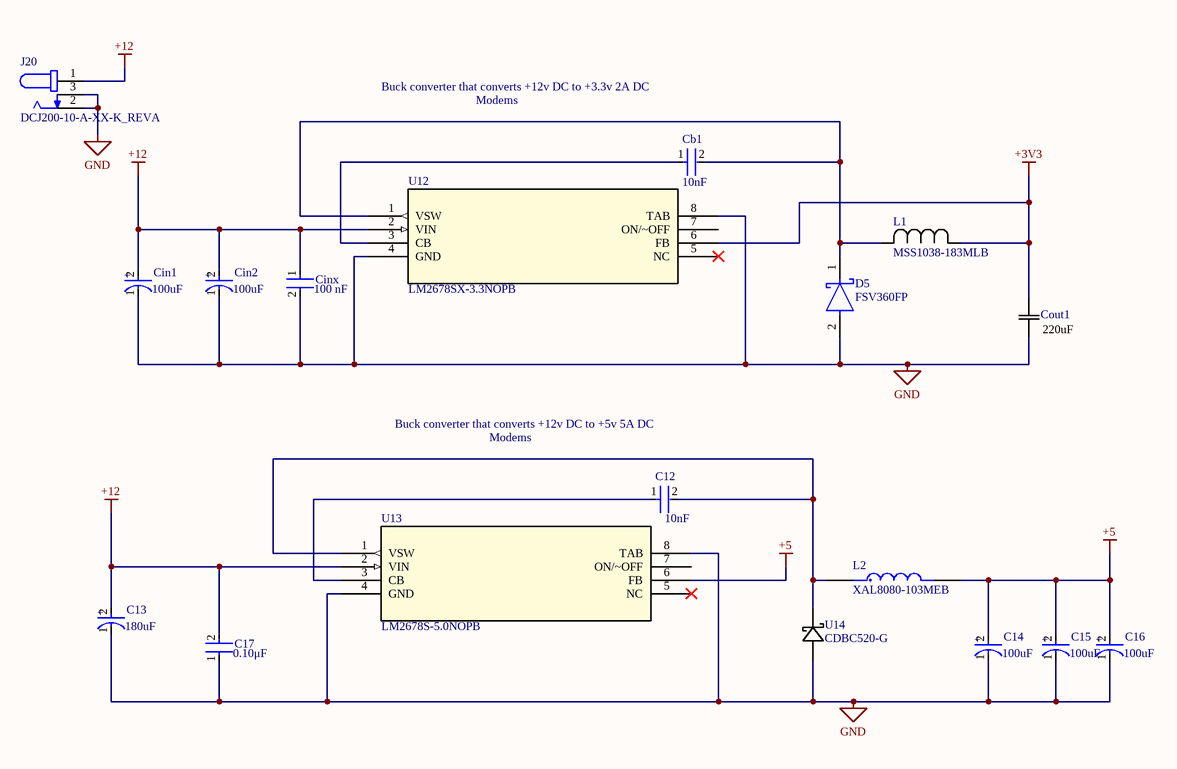
[diagram p8: Power.SchDoc]

### Parts
C12  Capacitance: 10nF  [FP-CGA4J-IPC_B]  (hidden comment: CGA4C2C0G1H103J060AA)
C13  Capacitance: 180uF  [FP-OS-CON-SMT-E7-MFG]  (hidden comment: 20SVPF180M)
C14  Capacitance: 100uF  [FP-POSCAP-B2-MFG]  (hidden comment: 8TPE100MAZB)
C15  Capacitance: 100uF  [FP-POSCAP-B2-MFG]  (hidden comment: 8TPE100MAZB)
C16  Capacitance: 100uF  [FP-POSCAP-B2-MFG]  (hidden comment: 8TPE100MAZB)
C17  Capacitance: 0.10μF  [FP-GRM15-MFG]  (hidden comment: GRM155R71C104KA88D)
Cb1  Capacitance: 10nF  [FP-CGA4J-IPC_B]  (hidden comment: CGA4C2C0G1H103J060AA)
Cin1  Capacitance: 100uF  [FP-FKF-MFG]  (hidden comment: EEE-FK1V101P)
Cin2  Capacitance: 100uF  [FP-FKF-MFG]  (hidden comment: EEE-FK1V101P)
Cinx  value 100 nF  [FP-CC0805-0_85-MFG]  (hidden comment: CC0805KRX7R8BB104)
Cout1  value 220uF  [CHEMI-F61]  (hidden comment: APXF6R3ARA221MF61G)
D5  FSV360FP  [FP-425AC-MFG]
J20  DCJ200-10-A-XX-K_REVA  [GCT_DCJ200-10-A-XX-K_REVA]
L1  MSS1038-183MLB  [IND_MSS1038_COC]
L2  XAL8080-103MEB  [IND_XAL8080-103MEB]
U12  LM2678SX-3.3NOPB  [TS7B]
U13  LM2678S-5.0NOPB  [TS7B]
U14  CDBC520-G  [CDBC-G]

### Nets
+3V3: Cout1.2 L1.1 U12.6(FB)
+5: C14.2(A) C15.2(A) C16.2(A) L2.2 U13.6(FB)
+12: C13.2(A) C17.2 Cin1.2(A) Cin2.2(A) Cinx.1 J20.1 U12.2(VIN) U13.2(VIN)
GND: C13.1(C) C14.1(C) C15.1(C) C16.1(C) C17.1 Cin1.1(C) Cin2.1(C) Cinx.2 Cout1.1 D5.2(A) J20.2 J20.3 U12.4(GND) U12.8(TAB) U13.4(GND) U13.8(TAB) U14.2
NetC12_1: C12.1 U13.3(CB)
NetC12_2: C12.2 L2.1 U13.1(VSW) U14.1
NetCb1_1: Cb1.1 U12.3(CB)
NetCb1_2: Cb1.2 D5.1(C) L1.2 U12.1(VSW)

Not connected (* = marked no-connect by the designer): U12 5(NC)* 7(ON/~OFF); U13 5(NC)* 7(ON/~OFF)

### Notes on the sheet
- Buck converter that converts +12v DC to +3.3v 2A DC
- Modems
- Buck converter that converts +12v DC to +5v 5A DC
- (in symbol CMP-05427-000084-1) +
- (in symbol CMP-05428-001015-1) +
- (in symbol CMP-05428-001341-1) +

### Library data of the parts
C12 Cb1 = CMP-08246-000595-1: Cap Ceramic 10nF 50V C0G 5% Pad SMD 0805 +125°C Automotive T/R; Max Operating Temperature: 125°C; Voltage Rating (DC): 50V; Packaging: Tape and Reel; Composition: Ceramic; Case/Package: 0805; REACH SVHC: No SVHC; Dielectric: C0G; Depth: 1.25mm; Min Operating Temperature: -55°C; Termination: SMD/SMT; Length: 2mm; Case Code (Metric): 2012; Thickness: 0.028inch; Ratings: AEC-Q200; Package Quantity: 1; Case Code (Imperial): 0805; Tolerance: 5%; Voltage Rating: 50V; Radiation Hardening: No; Lead Free: Lead Free; Height: 0.6mm; Mount: Surface Mount; Weight: 0.000194oz; Width: 0.049inch
C13 = CMP-05428-001015-1: Conductive Polymer Aluminum Solid Capacitors (OS-CON) 180uF ±20% 20V RADIAL SMT 8x6.9mm; Polarity: Polar; Life (Hours): 5000Hour; Leakage Current: 720uA; Dissipation Factor: 12%; Ripple Current (AC): 3.2A; ESR (Equivalent Series Resistance): 25mR; Voltage: 20V; Height: 6.9mm; Length: 6.9mm; Number of Pins: 7; Packaging: Tape and Reel; Mount: Surface Mount; Lead Free: Lead Free; Max Operating Temperature: 105°C; Voltage Rating: 20V; Construction: Cylindrical; REACH SVHC: No SVHC; Diameter: 8mm; Tolerance: 20%; Package Quantity: 1000; Voltage Rating (DC): 20V; Series: OS-CON™, SVPF; Termination: SMD/SMT; Min Operating Temperature: -55°C; Ripple Current: 3.2A; RoHS Compliant: Yes; Case/Package: Radial; Height - Seated (Max): 0.276inch
C14-C16 = CMP-05428-001341-1: Molded Tantalum Polymer Capacitor 100uF 20% 8V life 1000Hours SMD 1411; Ripple Current: 1.4A; Polarity: Polar; ESR (Equivalent Series Resistance): 35mR; Leakage Current: 80uA; Dissipation Factor: 8%; Number of Pins: 2; Mount: Surface Mount; Lead Free: Lead Free; Min Operating Temperature: -55°C; Height - Seated (Max): 0.079inch; Tolerance: 20%; Voltage Rating (DC): 8V; Series: POSCAP™ TPE; RoHS Compliant: Yes; Features: General Purpose; Length: 3.5mm; Depth: 2.8mm; Termination: SMD/SMT; Height: 1.9mm; Radiation Hardening: No; Width: 2.8mm; Voltage Rating: 8V; Construction: Flat; Case/Package: Molded; Package Quantity: 2000; Voltage: 8V; Max Operating Temperature: 105°C; Case Code (Imperial): 1210; Case Code (Metric): 3528; Packaging: Tape and Reel; REACH SVHC: No SVHC
C17 = CMP-2100-03641-2: CAP CER 0.1UF 16V X7R 0402; Manufacturer: Murata; Standoff Height: 0mm; Tolerance: 10%; Voltage Rating: 16Vdc; Material: Ceramic; Value: 0.10μF; RoHS: TRUE; Manufacturer Part Number: GRM155R71C104KA88D; Temperature Characteristic: X7R; Octopart: https://octopart.com/grm155r71c104ka88d-murata-196880; Digikey Description: CAP CER 0.1UF 16V X7R 0402; Device Class L3: Ceramic Capacitors; Height: 0.55mm; ComponentLink2Description: Datasheet; Temperature Range Low: -55°C; Ipc Land Pattern Name: CAPC10050X219; ComponentLink2URL: https://search.murata.co.jp/Ceramy/image/img/A01X/G101/ENG/GRM155R71H471KA01-01A.pdf; Device Class L1: Passive Components; Lead Free: yes; Category: Cap; Package: GRM15; Temperature: -55°C to +125°C; Device Class L2: Capacitors; Temperature Range High: +125°C; Mouser Description: 0402 0.1 uF 16V ±10 % Tolerance X7R SMT Multilayer Ceramic Capacitor
Cin1 Cin2 = CMP-05427-000084-1: CAP ALUM 100UF 20% 35V SMD; Leakage Current: 3uA; ESR (Equivalent Series Resistance): 160mR; Ripple Current (AC): 600mA; Life (Hours): 2000Hour; Dielectric Material: Aluminium; RoHS Compliant: Yes; Construction: Cylindrical; REACH SVHC: No SVHC; Width: 10mm; Min Operating Temperature: -55°C; Voltage Rating (DC): 35V; Voltage: 35V; Impedance: 160mR; Ripple Current: 600mA; Lead Free: Lead Free; Packaging: Tape and Reel; Radiation Hardening: No; Mount: Surface Mount; Termination: SMD/SMT; Max Operating Temperature: 105°C; Package Quantity: 1; Length: 10.2mm; Contact Plating: Tin; Case/Package: Radial; Series: FK; Number of Pins: 2; Tolerance: 20%; Voltage Rating: 35V; Diameter: 8mm; Height: 10.2mm; Height - Seated (Max): 0.402inch
Cinx = CMP-1036-04410-2: CAP CER 0.1UF 25V X7R 0805; Manufacturer: Yageo; Tolerance: 0.1; ComponentLink2URL: http://www.yageo.com/documents/recent/UPY-GPHC_Y5V_6.3V-to-50V_8.pdf; Category: Cap; Mouser Description: Multilayer Ceramic Capacitors MLCC - SMD/SMT 100nF 25V X7R 10%; Manufacturer Part Number: CC0805KRX7R8BB104; Device Class L1: Passive Components; Footprint Url: http://www.yageo.com/exep/pages/download/literatures/UPY-C_GEN_24.pdf; Height: 0.95mm; Material: Ceramic; Digikey Description: CAP CER 0.1UF 25V X7R 0805; Lead Free: Yes; Temperature Range High: +85°C; Temperature: -30°C to +85°C; Ipc Land Pattern Name: CAPC200125X85; Capacitance: 100 nF; Automotive: No; Octopart: https://octopart.com/cc0805krx7r8bb104-yageo-39467766; Device Class L2: Capacitors; Temperature Characteristic: X7R; Voltage Rating: 25 V; ComponentLink2Description: Datasheet; Temperature Range Low: -30°C; Device Class L3: Ceramic Capacitors; RoHS: TRUE; Package: CC0805-0.85; Parameter 1: *
Cout1 = APXF6R3ARA221MF61G: No Description Available; Mfr_Name: Nippon Chemi-Con
D5 = CMP-07162-000017-1: DIODE SCHOTTKY 60V 3A SOD123HE; Manufacturer: ON Semiconductor; Peak Reverse Current: 100uA; Max Surge Forward Current: 80A; Max Junction Temp: +150°C; ComponentLink2URL: https://www.onsemi.jp/PowerSolutions/document/FSV360FP-D.PDF; Device Class L1: Discrete Semiconductors; RoHS: TRUE; Temperature: -55°C to +150°C; ComponentLink2Description: Datasheet; Manufacturer Part Number: FSV360FP; Height: 1mm; Octopart: https://octopart.com/fsv360fp-on+semiconductor-84328668; Device Class L2: Diodes; Forward Current: 3A; Automotive: No; Device Class L3: Schottky Diodes; Reverse Voltage: 60V; Digikey Description: DIODE SCHOTTKY 60V 3A SOD123HE; Footprint Url: https://www.onsemi.com/pub/Collateral/425AC.PDF; Package: 425AC; Mouser Description: 60V 3A Schottky Barrier Rectifier in SOD-123HE / TAPE REEL; Max Repetitive Reverse Voltage: 60V; Category: Diode; Lead Free: Yes; Temperature Range High: +150°C; Temperature Range Low: -55°C
J20 = DCJ200-10-A-XX-K_REVA: Power Barrel Connector Jack 2.05mm ID (0.081), 5.50mm OD (0.217) Through Hole, Right Angle; MF: Global Connector Technology; MP: DCJ200-10-A-K1-K; SnapEDA_Link: https://www.snapeda.com/parts/DCJ200-10-A-K1-K/Global+Connector+Technology/view-part/?ref=snap; Package: None; Value: *; Check_prices: https://www.snapeda.com/parts/DCJ200-10-A-K1-K/Global+Connector+Technology/view-part/?ref=eda
L1 = MSS1038-183MLB: No Description Available; Mfr_Name: Coilcraft
U12 = LM2678SX-3.3NOPB: No Description Available; Mfr_Name: Texas Instruments; Type: LM2678S-12; RefDes: RefDes
U13 = LM2678S-5.0NOPB: No Description Available; Mfr_Name: Texas Instruments; Type: LM2678S-12; RefDes: RefDes
U14 = CDBC520-G: No Description Available; Mfr_Name: Comchip
L2 = XAL8080-103MEB: Value: *; Availability: Unavailable; Price: None; MP: XAL8080-103MEB; Package: None

## Sheet High Speed RPI CM.SchDoc
size A4; SheetNumber: 11; SheetTotal: 11